# Altium project Stm32F429Zg.PrjPcb (part 2 of 3)

## Sheet GSM.SchDoc
size A2; SheetNumber: 3; SheetTotal: 8
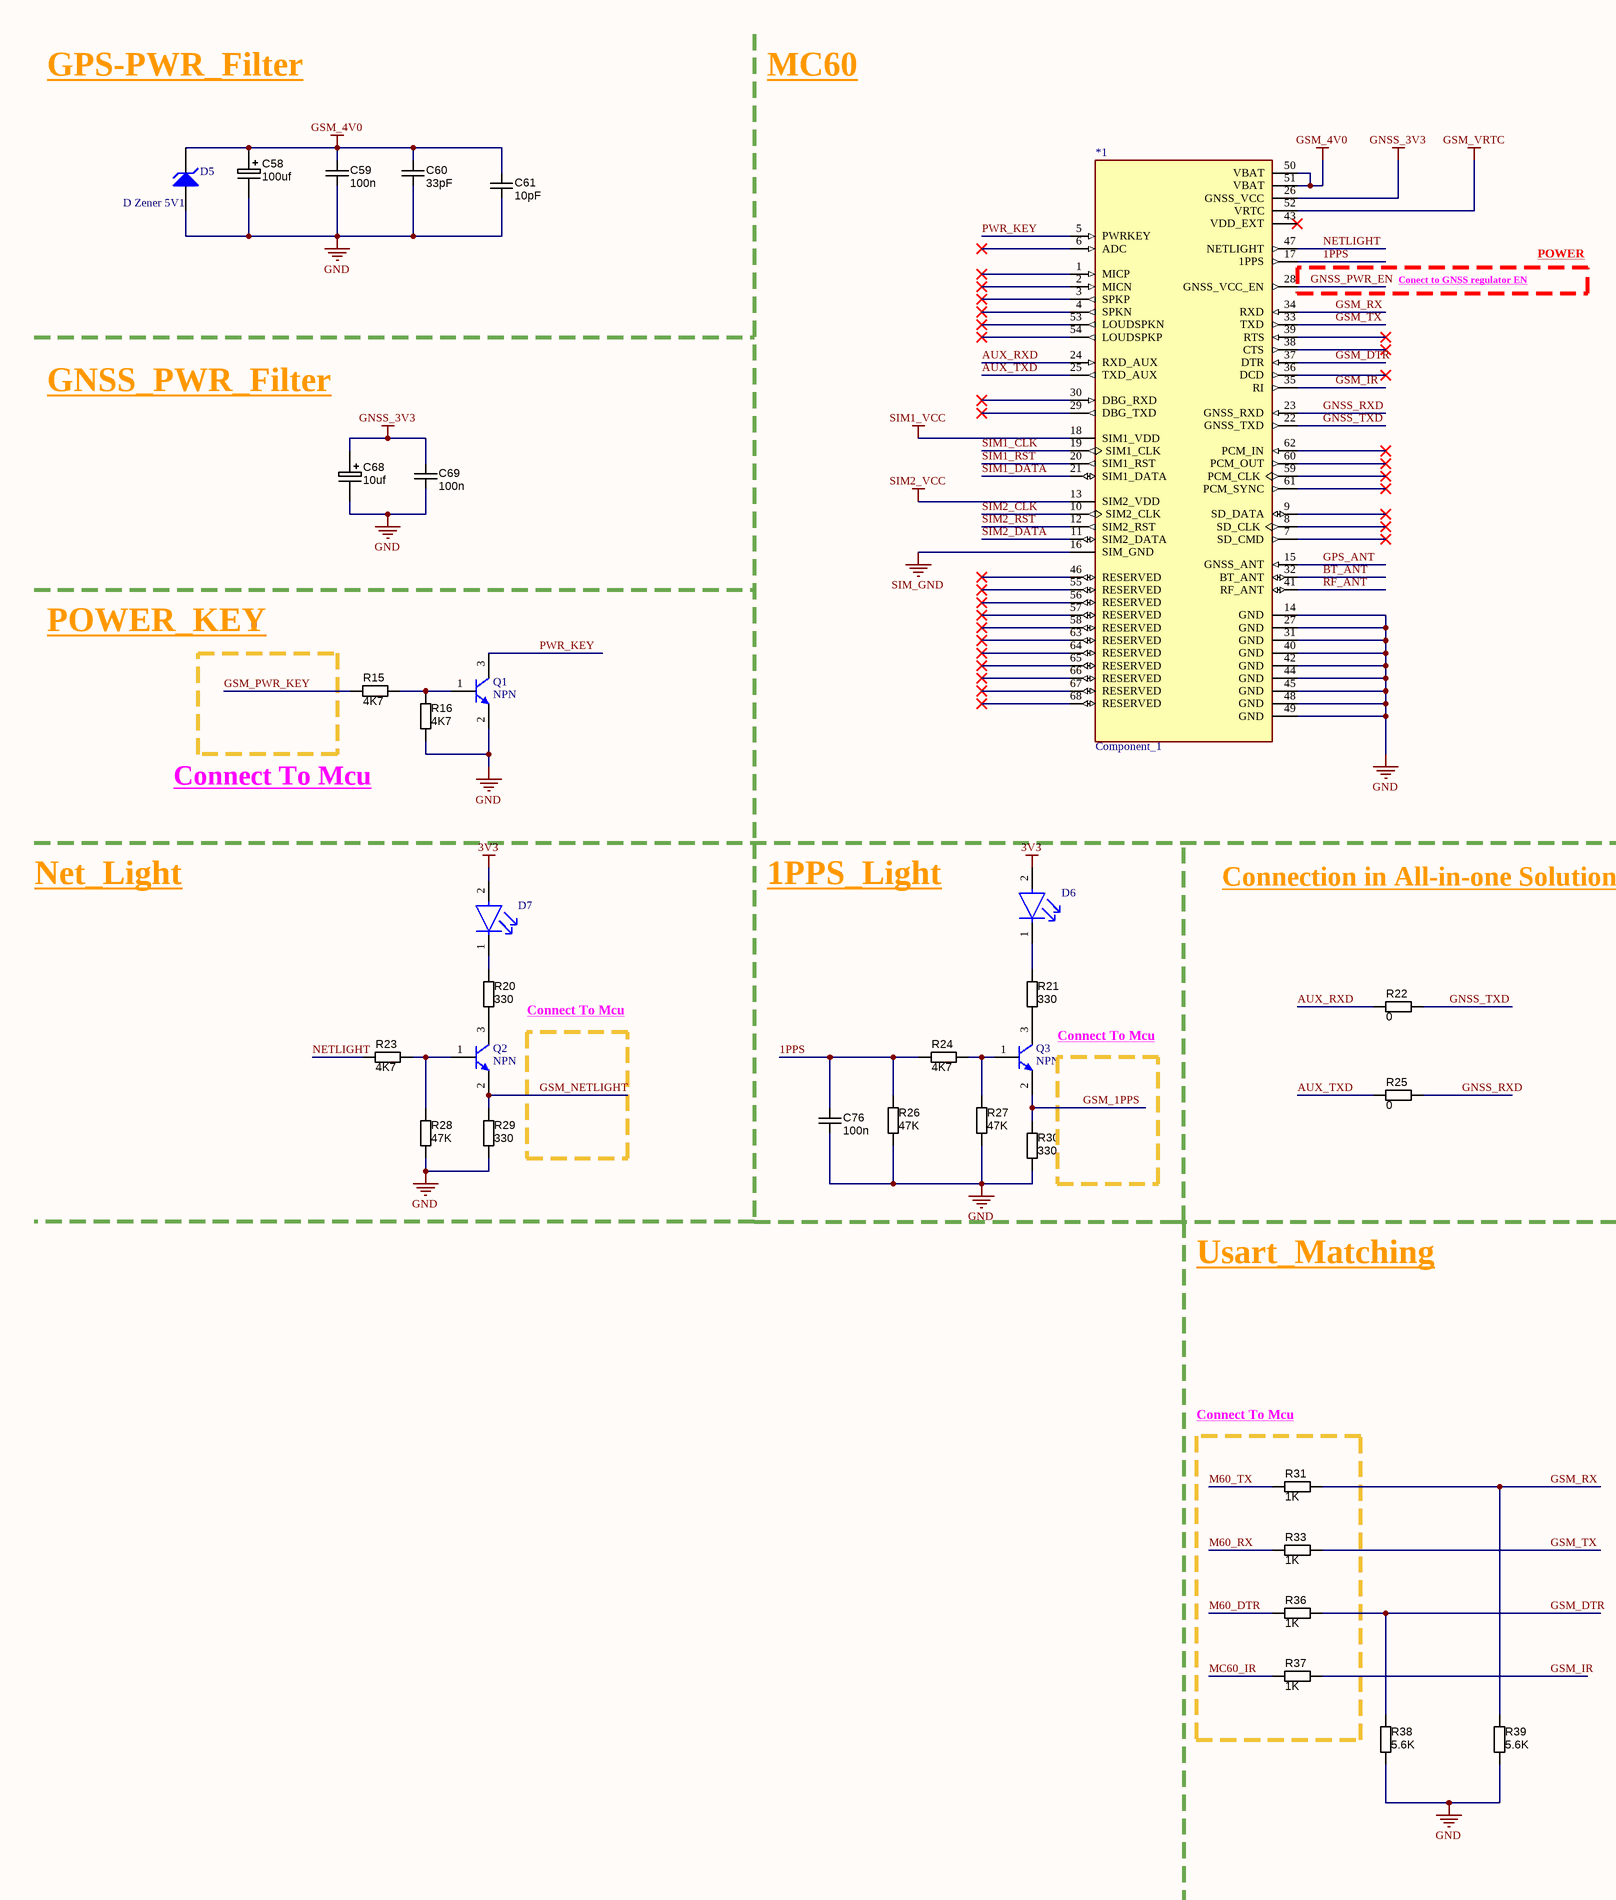
[diagram p2: GSM.SchDoc, left]
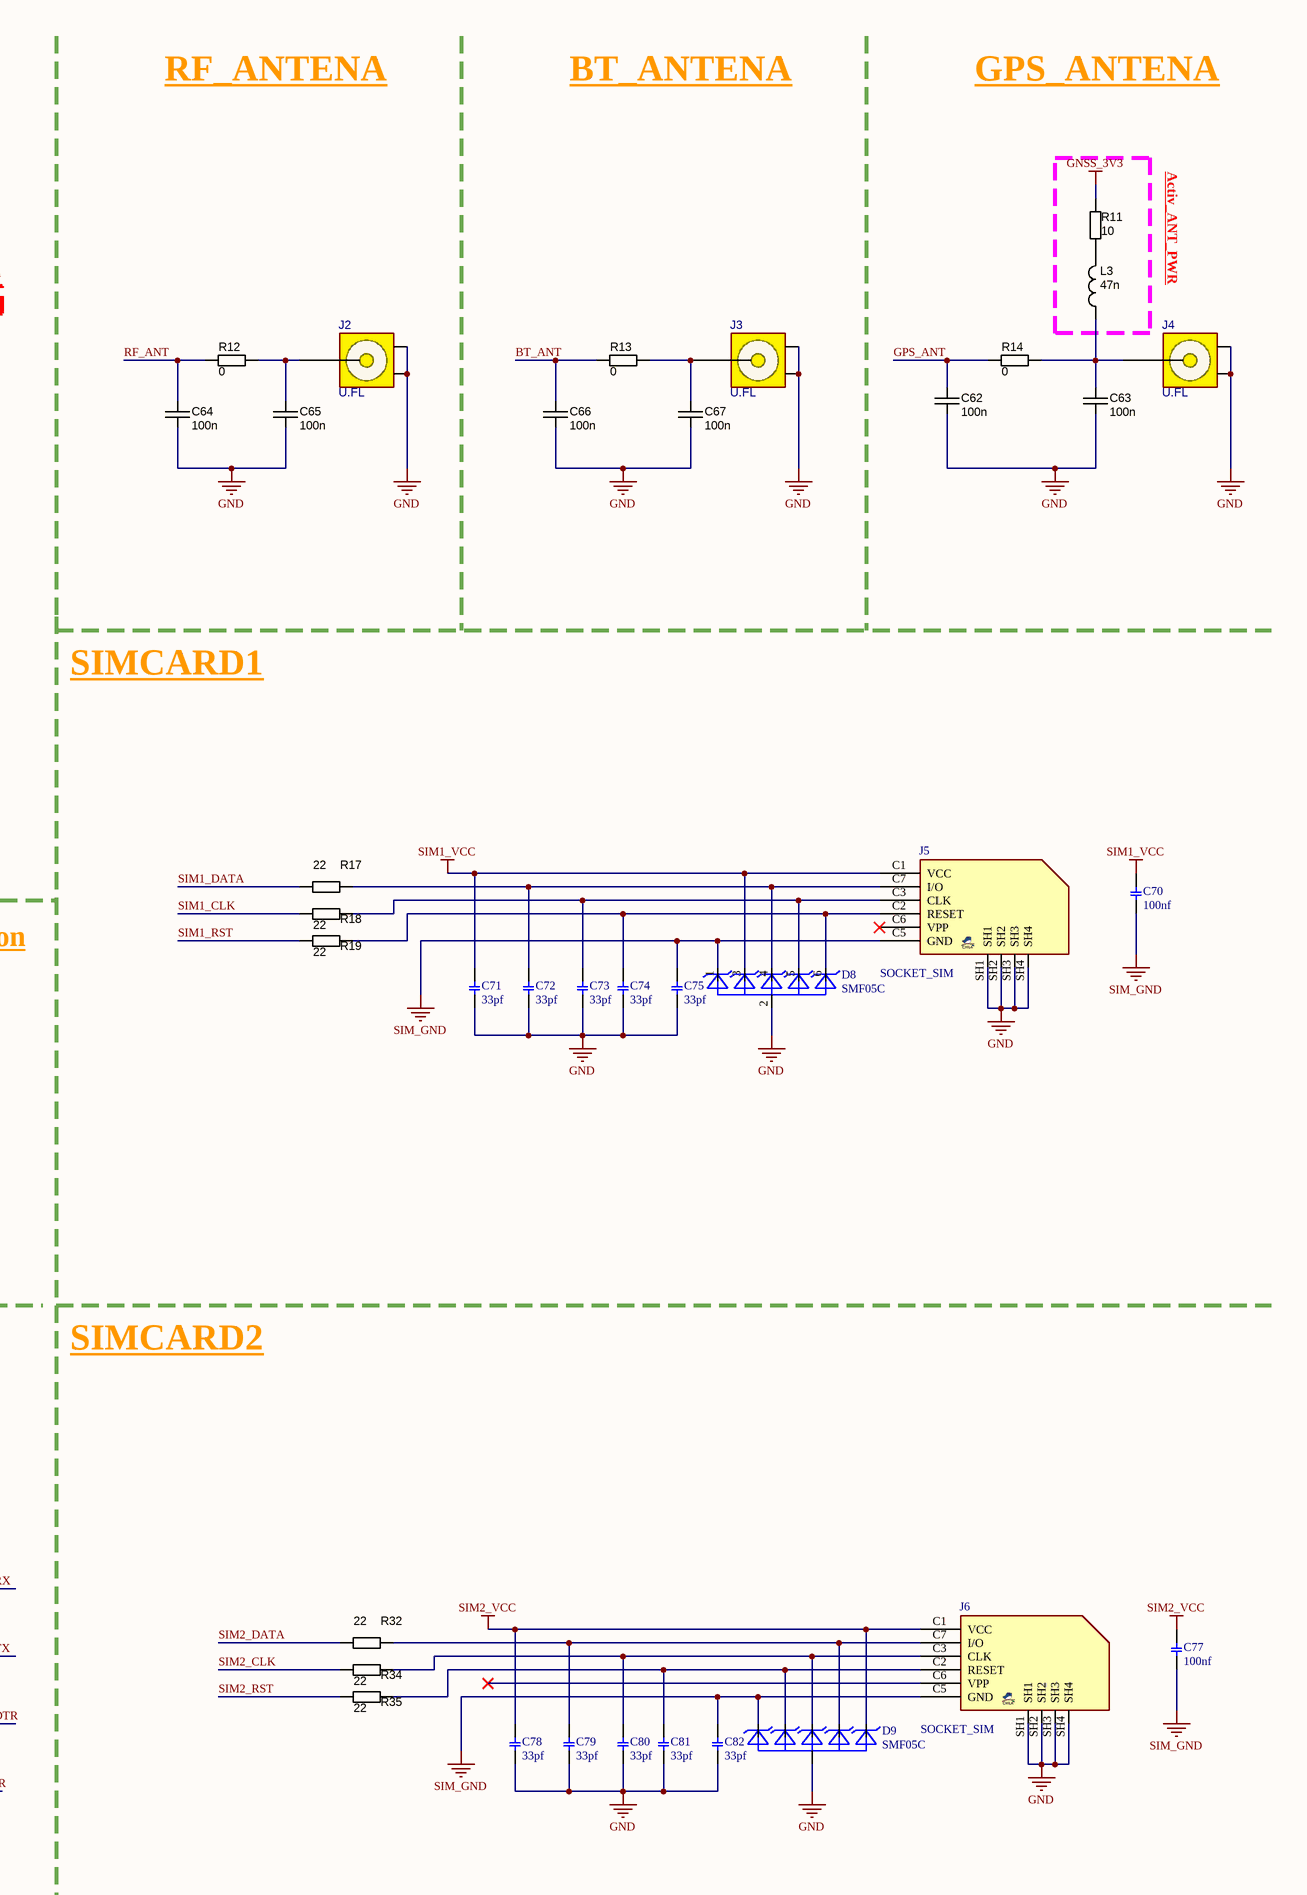
[diagram p3: GSM.SchDoc, right]

### Parts
*1  Component_1  [PCBComponent_1]
C58  value 100uf  [C_TN_3528]
C59  value 100n  [CAPC1608X90N]  (hidden comment: approved sub OK)
C60  value 33pF  [CAPC1608X90N]  (hidden comment: approved sub OK)
C61  value 10pF  [CAPC1608X90N]  (hidden comment: approved sub OK)
C62  value 100n  [C0402]  (hidden comment: approved sub OK)
C63  value 100n  [C0402]  (hidden comment: approved sub OK)
C64  value 100n  [C0402]  (hidden comment: approved sub OK)
C65  value 100n  [C0402]  (hidden comment: approved sub OK)
C66  value 100n  [C0402]  (hidden comment: approved sub OK)
C67  value 100n  [C0402]  (hidden comment: approved sub OK)
C68  value 10uf  [C_TN_3528]
C69  value 100n  [CAPC1608X90N]  (hidden comment: approved sub OK)
C70  value 100nf  [0603]  (hidden comment: Capacitor C SMD 0603)
C71  value 33pf  [0603]  (hidden comment: Capacitor C SMD 0603)
C72  value 33pf  [0603]  (hidden comment: Capacitor C SMD 0603)
C73  value 33pf  [0603]  (hidden comment: Capacitor C SMD 0603)
C74  value 33pf  [0603]  (hidden comment: Capacitor C SMD 0603)
C75  value 33pf  [0603]  (hidden comment: Capacitor C SMD 0603)
C76  value 100n  [CAPC1608X90N]  (hidden comment: approved sub OK)
C77  value 100nf  [0603]  (hidden comment: Capacitor C SMD 0603)
C78  value 33pf  [0603]  (hidden comment: Capacitor C SMD 0603)
C79  value 33pf  [0603]  (hidden comment: Capacitor C SMD 0603)
C80  value 33pf  [0603]  (hidden comment: Capacitor C SMD 0603)
C81  value 33pf  [0603]  (hidden comment: Capacitor C SMD 0603)
C82  value 33pf  [0603]  (hidden comment: Capacitor C SMD 0603)
D5  D Zener 5V1  [DIODE-0.7]
D6  LTST-C191TBKT  [FP-LTST-C191TBKT-MFG]  (value not drawn)
D7  LTST-C191TBKT  [FP-LTST-C191TBKT-MFG]  (value not drawn)
D8  SMF05C  [SC70-6]
D9  SMF05C  [SC70-6]
J2  U.FL  [UFL]
J3  U.FL  [UFL]
J4  U.FL  [UFL]
J5  SOCKET_SIM  [SIM_MICRO_GCT]
J6  SOCKET_SIM  [SIM_MICRO_GCT]
L3  47n  [L0603]
Q1  NPN  [SOT23-3]
Q2  NPN  [SOT23-3]
Q3  NPN  [SOT23-3]
R11  value 10  [0402]  (hidden comment: Thick Film)
R12  value 0  [0402]  (hidden comment: Thick Film)
R13  value 0  [0402]  (hidden comment: Thick Film)
R14  value 0  [0402]  (hidden comment: Thick Film)
R15  value 4K7  [RESC1608X55N]  (hidden comment: Thick Film)
R16  value 4K7  [RESC1608X55N]  (hidden comment: Thick Film)
R17  value 22  [RESC1608X55N]  (hidden comment: Thick Film)
R18  value 22  [RESC1608X55N]  (hidden comment: Thick Film)
R19  value 22  [RESC1608X55N]  (hidden comment: Thick Film)
R20  value 330  [RESC1608X55N]  (hidden comment: Thick Film)
R21  value 330  [RESC1608X55N]  (hidden comment: Thick Film)
R22  value 0  [RESC1608X55N]  (hidden comment: Thick Film)
R23  value 4K7  [RESC1608X55N]  (hidden comment: Thick Film)
R24  value 4K7  [RESC1608X55N]  (hidden comment: Thick Film)
R25  value 0  [RESC1608X55N]  (hidden comment: Thick Film)
R26  value 47K  [RESC1608X55N]  (hidden comment: Thick Film)
R27  value 47K  [RESC1608X55N]  (hidden comment: Thick Film)
R28  value 47K  [RESC1608X55N]  (hidden comment: Thick Film)
R29  value 330  [RESC1608X55N]  (hidden comment: Thick Film)
R30  value 330  [RESC1608X55N]  (hidden comment: Thick Film)
R31  value 1K  [RESC1608X55N]  (hidden comment: Thick Film)
R32  value 22  [RESC1608X55N]  (hidden comment: Thick Film)
R33  value 1K  [RESC1608X55N]  (hidden comment: Thick Film)
R34  value 22  [RESC1608X55N]  (hidden comment: Thick Film)
R35  value 22  [RESC1608X55N]  (hidden comment: Thick Film)
R36  value 1K  [RESC1608X55N]  (hidden comment: Thick Film)
R37  value 1K  [RESC1608X55N]  (hidden comment: Thick Film)
R38  value 5.6K  [RESC1608X55N]  (hidden comment: Thick Film)
R39  value 5.6K  [RESC1608X55N]  (hidden comment: Thick Film)

### Blocks framed on the sheet
Connect To Mcu: R31 R33 R36 R37

### Nets
3V3: D6.2(A) D7.2(A)  [project net VDD]
GND: *1.14(GND) *1.27(GND) *1.31(GND) *1.40(GND) *1.42(GND) *1.44(GND) *1.45(GND) *1.48(GND) *1.49(GND) C58.2 C59.2 C60.2 C61.2 C62.2 C63.2 C64.2 C65.2 C66.2 C67.2 C68.2 C69.2 C71.1 C72.1 C73.1 C74.1 C75.1 C76.2 C78.1 C79.1 C80.1 C81.1 C82.1 D5.1(A) D8.2(A) D9.2(A) J2.2(G1) J2.3(G2) J3.2(G1) J3.3(G2) J4.2(G1) J4.3(G2) J5.SH1 J5.SH2 J5.SH3 J5.SH4 J6.SH1 J6.SH2 J6.SH3 J6.SH4 Q1.2(E) R16.2 R26.2 R27.2 R28.2 R29.2 R30.2 R38.2 R39.2
GNSS_3V3: *1.26(GNSS_VCC) C68.1 C69.1 R11.1
GSM_4V0: *1.50(VBAT) *1.51(VBAT) C58.1 C59.1 C60.1 C61.1 D5.2(K)
GSM_VRTC: *1.52(VRTC)
SIM1_VCC: *1.18(SIM1_VDD) C70.2 C71.2 D8.3(C2) J5.C1(VCC)
SIM2_VCC: *1.13(SIM2_VDD) C77.2 C78.2 D9.6(C5) J6.C1(VCC)
SIM_GND: *1.16(SIM_GND) C70.1 C75.2 C77.1 C82.2 D8.1(C1) D9.1(C1) J5.C5(GND) J6.C5(GND)
1PPS: *1.17(1PPS) C76.1 R24.1 R26.1
AUX_RXD: *1.24(RXD_AUX) R22.2
AUX_TXD: *1.25(TXD_AUX) R25.2
BT_ANT: *1.32(BT_ANT) C66.1 R13.2
GNSS_PWR_EN: *1.28(GNSS_VCC_EN)
GNSS_RXD: *1.23(GNSS_RXD) R25.1
GNSS_TXD: *1.22(GNSS_TXD) R22.1
GPS_ANT: *1.15(GNSS_ANT) C62.1 R14.2
GSM_1PPS: Q3.2(E) R30.1
GSM_DTR: *1.37(DTR) R36.1 R38.1
GSM_IR: *1.35(RI) R37.1
GSM_NETLIGHT: Q2.2(E) R29.1
GSM_PWR_KEY: R15.2
GSM_RX: *1.34(RXD) R31.1 R39.1
GSM_TX: *1.33(TXD) R33.1
M60_DTR: R36.2
M60_RX: R33.2
M60_TX: R31.2
MC60_IR: R37.2
NETLIGHT: *1.47(NETLIGHT) R23.1
PWR_KEY: *1.5(PWRKEY) Q1.3(C)
RF_ANT: *1.41(RF_ANT) C64.1 R12.2
SIM1_CLK: *1.19(SIM1_CLK) R18.1
SIM1_DATA: *1.21(SIM1_DATA) R17.1
SIM1_RST: *1.20(SIM1_RST) R19.1
SIM2_CLK: *1.10(SIM2_CLK) R34.1
SIM2_DATA: *1.11(SIM2_DATA) R32.1
SIM2_RST: *1.12(SIM2_RST) R35.1
NetC63_1: C63.1 J4.1(SIG) L3.1 R14.1
NetC65_1: C65.1 J2.1(SIG) R12.1
NetC67_1: C67.1 J3.1(SIG) R13.1
NetC72_2: C72.2 D8.4(C3) J5.C7(I/O) R17.2
NetC73_2: C73.2 D8.5(C4) J5.C3(CLK) R18.2
NetC74_2: C74.2 D8.6(C5) J5.C2(RESET) R19.2
NetC79_2: C79.2 D9.5(C4) J6.C7(I/O) R32.2
NetC80_2: C80.2 D9.4(C3) J6.C3(CLK) R34.2
NetC81_2: C81.2 D9.3(C2) J6.C2(RESET) R35.2
NetD6_1: D6.1(C) R21.1
NetD7_1: D7.1(C) R20.1
NetL3_2: L3.2 R11.2
NetQ1_1: Q1.1(B) R15.1 R16.1
NetQ2_1: Q2.1(B) R23.2 R28.1
NetQ2_3: Q2.3(C) R20.2
NetQ3_1: Q3.1(B) R24.2 R27.1
NetQ3_3: Q3.3(C) R21.2

Not connected (* = marked no-connect by the designer): *1 1(MICP)* 2(MICN)* 3(SPKP)* 4(SPKN)* 6(ADC)* 7(SD_CMD)* 8(SD_CLK)* 9(SD_DATA)* 29(DBG_TXD)* 30(DBG_RXD)* 36(DCD)* 38(CTS)* 39(RTS)* 43(VDD_EXT)* 46(RESERVED)* 53(LOUDSPKN)* 54(LOUDSPKP)* 55(RESERVED)* 56(RESERVED)* 57(RESERVED)* 58(RESERVED)* 59(PCM_CLK)* 60(PCM_OUT)* 61(PCM_SYNC)* 62(PCM_IN)* 63(RESERVED)* 64(RESERVED)* 65(RESERVED)* 66(RESERVED)* 67(RESERVED)* 68(RESERVED)*; J5 C6(VPP)*; J6 C6(VPP)*

### Notes on the sheet
- GPS-PWR_Filter
- MC60
- RF_ANTENA
- BT_ANTENA
- GPS_ANTENA
- Activ_ANT_PWR
- Conect to GNSS regulator EN
- POWER
- GNSS_PWR_Filter
- POWER_KEY
- SIMCARD1
- Connect To Mcu
- Net_Light
- 1PPS_Light
- Connection in All-in-one Solution
- Usart_Matching
- SIMCARD2
- Title:
- Serial Number:
- Author:
- Revision:
- AmirMahdiHasanzadeh
- 4LB_V1.0.0
- Sheet       of
- Drawn By:
- Sheet Size: A2
- 3
- AmirMAhdiHasanzadeh
- File:
- Approved By:
- Date:
- 2021/11/08

### Library data of the parts
C58 = CAPT_4u7_3216_16V: Capacitor SMD Tantalum 100uF 10% 16V 3216-18; Manufacturer 1: Vishay/Sprague; Manufacturer Part Number 1: 293D475X9016A2TE3; SCDType: undef; Package / Case: EIA 535BAAC size A; Ratings: 16V; Tolerance: ±10%; Material: Tantalum; Supplier 1: Digi-Key; Supplier Part Number 1: 718-1148-1-ND
C59 C62-C67 C69 C76 = CAPC_100n_0603_X7R_50V_10%: Capacitor SMD Cer 100nF 10% 50V X7R 0603; Manufacturer 1: AVX Corporation; Manufacturer Part Number 1: 06035C104KAT2A; Ratings: 50V; X7R; Material: ceramic; SCDType: spec; Manufacturer 2: TDK Corporation; Manufacturer Part Number 2: C1608X7R1H104K; Package / Case: 0603 (1608 Metric); Tolerance: ±10%; Supplier 1: Digi-Key; Supplier Part Number 1: 478-5052-1-ND; ComponentLink1URL: http://www.avx.com/docs/Catalogs/cx7r.pdf; ComponentLink1Description: http://www.avx.com/docs/Catalogs/cx7r.pdf; Supplier 2: Digi-Key; Supplier Part Number 2: 445-1314-1-ND; ComponentLink2URL: http://product.tdk.com/capacitor/mlcc/en/documents/mlcc_commercial_general_en.pdf; ComponentLink2Description: http://product.tdk.com/capacitor/mlcc/en/documents/mlcc_commercial_general_en.pdf
C60 = CAPC_100n_0603_X7R_50V_10%: Capacitor SMD Cer 33pF10% 50V X7R 0603; Manufacturer 1: AVX Corporation; Manufacturer Part Number 1: 06035C104KAT2A; Tolerance: ±10%; Ratings: 50V; X7R; Material: ceramic; SCDType: spec; Manufacturer 2: TDK Corporation; Manufacturer Part Number 2: C1608X7R1H104K; Package / Case: 0603 (1608 Metric); Supplier 1: Digi-Key; Supplier Part Number 1: 478-5052-1-ND; ComponentLink1URL: http://www.avx.com/docs/Catalogs/cx7r.pdf; ComponentLink1Description: http://www.avx.com/docs/Catalogs/cx7r.pdf; Supplier 2: Digi-Key; Supplier Part Number 2: 445-1314-1-ND; ComponentLink2URL: http://product.tdk.com/capacitor/mlcc/en/documents/mlcc_commercial_general_en.pdf; ComponentLink2Description: http://product.tdk.com/capacitor/mlcc/en/documents/mlcc_commercial_general_en.pdf
C61 = CAPC_100n_0603_X7R_50V_10%: Capacitor SMD Cer 10pF10% 50V X7R 0603; Manufacturer 1: AVX Corporation; Manufacturer Part Number 1: 06035C104KAT2A; Tolerance: ±10%; Ratings: 50V; X7R; Material: ceramic; SCDType: spec; Manufacturer 2: TDK Corporation; Manufacturer Part Number 2: C1608X7R1H104K; Package / Case: 0603 (1608 Metric); Supplier 1: Digi-Key; Supplier Part Number 1: 478-5052-1-ND; ComponentLink1URL: http://www.avx.com/docs/Catalogs/cx7r.pdf; ComponentLink1Description: http://www.avx.com/docs/Catalogs/cx7r.pdf; Supplier 2: Digi-Key; Supplier Part Number 2: 445-1314-1-ND; ComponentLink2URL: http://product.tdk.com/capacitor/mlcc/en/documents/mlcc_commercial_general_en.pdf; ComponentLink2Description: http://product.tdk.com/capacitor/mlcc/en/documents/mlcc_commercial_general_en.pdf
C68 = CAPT_4u7_3216_16V: Capacitor SMD Tantalum 10uF 10% 16V 3216-18; Manufacturer 1: Vishay/Sprague; Manufacturer Part Number 1: 293D475X9016A2TE3; SCDType: undef; Package / Case: EIA 535BAAC size A; Ratings: 16V; Tolerance: ±10%; Material: Tantalum; Supplier 1: Digi-Key; Supplier Part Number 1: 718-1148-1-ND
D5 = D Zener: Zener Diode; Published: 8-Jun-2000; LatestRevisionDate: 17-Jul-2002; LatestRevisionNote: Re-released for DXP Platform.; PackageReference: DIODE-0.7; Publisher: Altium Limited; PackageDescription: Diode, Thru-Hole; 2 Leads; 0.7 in Pin Spacing
D6 D7 = CMP-22017-000008-1: LED BLUE CLEAR CHIP SMD; Lens Color: Colorless; Dominant Wavelength: 475nm; Forward Current: 20mA; Wavelength: 468nm; Viewing Angle: 130°; Power Dissipation: 76mW; Luminous Intensity: 180mcd; Reverse Voltage: 5V; Number of Elements: 1; Lens Style: Diffused; Forward Voltage: 3.8V; Max Power Dissipation: 75mW; Case Code (Metric): 1608; Packaging: Tape and Reel; Case/Package: 0603; Depth: 1.6mm; Mount: Surface Mount; Lead Free: Lead Free; Min Operating Temperature: -20°C; Lens Transparency: Clear; Illumination Color: Blue; Height: 0.55mm; Test Current: 20mA; Case Code (Imperial): 0603; Max Operating Temperature: 80°C; Number of Pins: 2; Length: 0.8mm; Radiation Hardening: No; Package Quantity: 1; Number of LEDs: 1; Width: 0.8mm; Color: Blue
D8 D9 = SMF05C: 12.5V Clamp 8A _8/20Âµs_ Ipp Tvs Diode Surface Mount SC-88/SC70-6/SOT-363; MF: ON Semiconductor; Availability: Unavailable; Price: None; Package: SOT-363 ON Semiconductor; Value: *; SnapEDA_Link: https://www.snapeda.com/parts/SMF05C/ON%20Semiconductor/view-part/2782704/?ref=snap; MP: SMF05C
J2-J4 = CONN_RF_UFL: CONN, RF, U.FL, STRAIGHT, Ultra Miniature Coaxial; MANF_P#: CONUFL001-SMD, U.FL-R-SMT-1(10), 128-0711-201; MANF: Linx, Hirose, Cinch; PARAM: 50Ohm, 6GHz; DESC: DESCRIPTION; DIST#: DIGIKEY, MOUSER; PARAM2: GOLD; ASSEMBLY: ASSEMBLY; PRICE: 0.9$; VALUE: U.FL
J5 J6 = SIM_MICRO_6: SOCKET, SIM MICRO; MANF: -; PRICE: 3t@Lion Iran; MANF_P#: -; DESC: -; VALUE: SOCKET_SIM
L3 = INDC_10u_LowRDC: Inductor SMD Low DCR 47 nH 900mA 20% 1210; Manufacturer 1: Taiyo Yuden; Manufacturer Part Number 1: CBC3225T100MR; Ratings: 900 mA; 133 mOhm; DC Resistance (DCR): 172.9 mOhm Max; Frequency - Self Resonant: 23MHz; Frequency - Test: 100kHz; SCDType: spec; Tolerance: ±20%; Supplier 1: Digi-Key; Supplier Part Number 1: 587-1625-1-ND; Current: 900mA; Current - Saturation: 900mA; Current - Temperature Rise: 900mA; Applications: Power Supplies; Package / Case: 1210 (3225 Metric); Operating Temperature: -40°C ~ 105°C; ComponentLink1URL: http://www.yuden.co.jp/ut/product/pdf/wound02_e.pdf; ComponentLink1Description: http://www.yuden.co.jp/ut/product/pdf/wound02_e.pdf; Value: 47n
Q1-Q3 = NPN: NPN Bipolar Transistor; Published: 8-Jun-2000; LatestRevisionDate: 17-Jul-2002; LatestRevisionNote: Re-released for DXP Platform.; PackageReference: TO-226-AA; Publisher: Altium Limited; PackageDescription: TO, Flat Index; 3 In-Line, Axial Leads; Body Dia. 4.8mm; Leads 0.55 x 0.51 mm (max); Code_JEDEC: TO-226-AA
R11 = RES_4K7_0603_5%: Resistor SMD chip 10 Ohm 0.1W 5% 0603; Manufacturer 1: Vishay/Dale; Manufacturer Part Number 1: CRCW06034K70JNEA; Ratings: 1/10 W; SCDType: spec; Package / Case: 0603 (1608 metric); Tolerance: ±5%; Material: Thick Film; Supplier 1: Digi-Key; Supplier Part Number 1: 541-4.7KGCT-ND
R12-R14 R22 R25 = RES_4K7_0603_5%: Resistor SMD chip 0 Ohm 0.1W 5% 0603; Manufacturer 1: Vishay/Dale; Manufacturer Part Number 1: CRCW06034K70JNEA; Ratings: 1/10 W; SCDType: spec; Package / Case: 0603 (1608 metric); Tolerance: ±5%; Material: Thick Film; Supplier 1: Digi-Key; Supplier Part Number 1: 541-4.7KGCT-ND
R15 R16 R23 R24 = RES_4K7_0603_5%: Resistor SMD chip 4.7k Ohm 0.1W 5% 0603; Manufacturer 1: Vishay/Dale; Manufacturer Part Number 1: CRCW06034K70JNEA; Ratings: 1/10 W; SCDType: spec; Package / Case: 0603 (1608 metric); Tolerance: ±5%; Material: Thick Film; Supplier 1: Digi-Key; Supplier Part Number 1: 541-4.7KGCT-ND
R17-R19 R32 R34 R35 = RES_4K7_0603_5%: Resistor SMD chip 22 Ohm 0.1W 5% 0603; Manufacturer 1: Vishay/Dale; Manufacturer Part Number 1: CRCW06034K70JNEA; Ratings: 1/10 W; SCDType: spec; Package / Case: 0603 (1608 metric); Tolerance: ±5%; Material: Thick Film; Supplier 1: Digi-Key; Supplier Part Number 1: 541-4.7KGCT-ND
R20 R21 R29 R30 = RES_4K7_0603_5%: Resistor SMD chip 330 Ohm 0.1W 5% 0603; Manufacturer 1: Vishay/Dale; Manufacturer Part Number 1: CRCW06034K70JNEA; Ratings: 1/10 W; SCDType: spec; Package / Case: 0603 (1608 metric); Tolerance: ±5%; Material: Thick Film; Supplier 1: Digi-Key; Supplier Part Number 1: 541-4.7KGCT-ND
R26-R28 = RES_4K7_0603_5%: Resistor SMD chip 47K Ohm 0.1W 5% 0603; Manufacturer 1: Vishay/Dale; Manufacturer Part Number 1: CRCW06034K70JNEA; Ratings: 1/10 W; SCDType: spec; Package / Case: 0603 (1608 metric); Tolerance: ±5%; Material: Thick Film; Supplier 1: Digi-Key; Supplier Part Number 1: 541-4.7KGCT-ND
R31 R33 R36 R37 = RES_4K7_0603_5%: Resistor SMD chip 1K Ohm 0.1W 5% 0603; Manufacturer 1: Vishay/Dale; Manufacturer Part Number 1: CRCW06034K70JNEA; Ratings: 1/10 W; SCDType: spec; Package / Case: 0603 (1608 metric); Tolerance: ±5%; Material: Thick Film; Supplier 1: Digi-Key; Supplier Part Number 1: 541-4.7KGCT-ND
R38 R39 = RES_4K7_0603_5%: Resistor SMD chip 5.6K Ohm 0.1W 5% 0603; Manufacturer 1: Vishay/Dale; Manufacturer Part Number 1: CRCW06034K70JNEA; Ratings: 1/10 W; SCDType: spec; Package / Case: 0603 (1608 metric); Tolerance: ±5%; Material: Thick Film; Supplier 1: Digi-Key; Supplier Part Number 1: 541-4.7KGCT-ND
C70-C75 C77-C82 = Capacitor C SMD 0603: DatasheetVersion: 2021; ComponentLink1Description: Website Smart World; ComponentLink1URL: https://www.smartw.ir/; ComponentLink2Description: Telegram; ComponentLink2URL: https://t.me/altium_smartw; ComponentLink3Description: Instagram; ComponentLink3URL: https://Instagram.com/smartgw.ir

## Sheet ADC.SchDoc
size A4; SheetNumber: 4; SheetTotal: 8
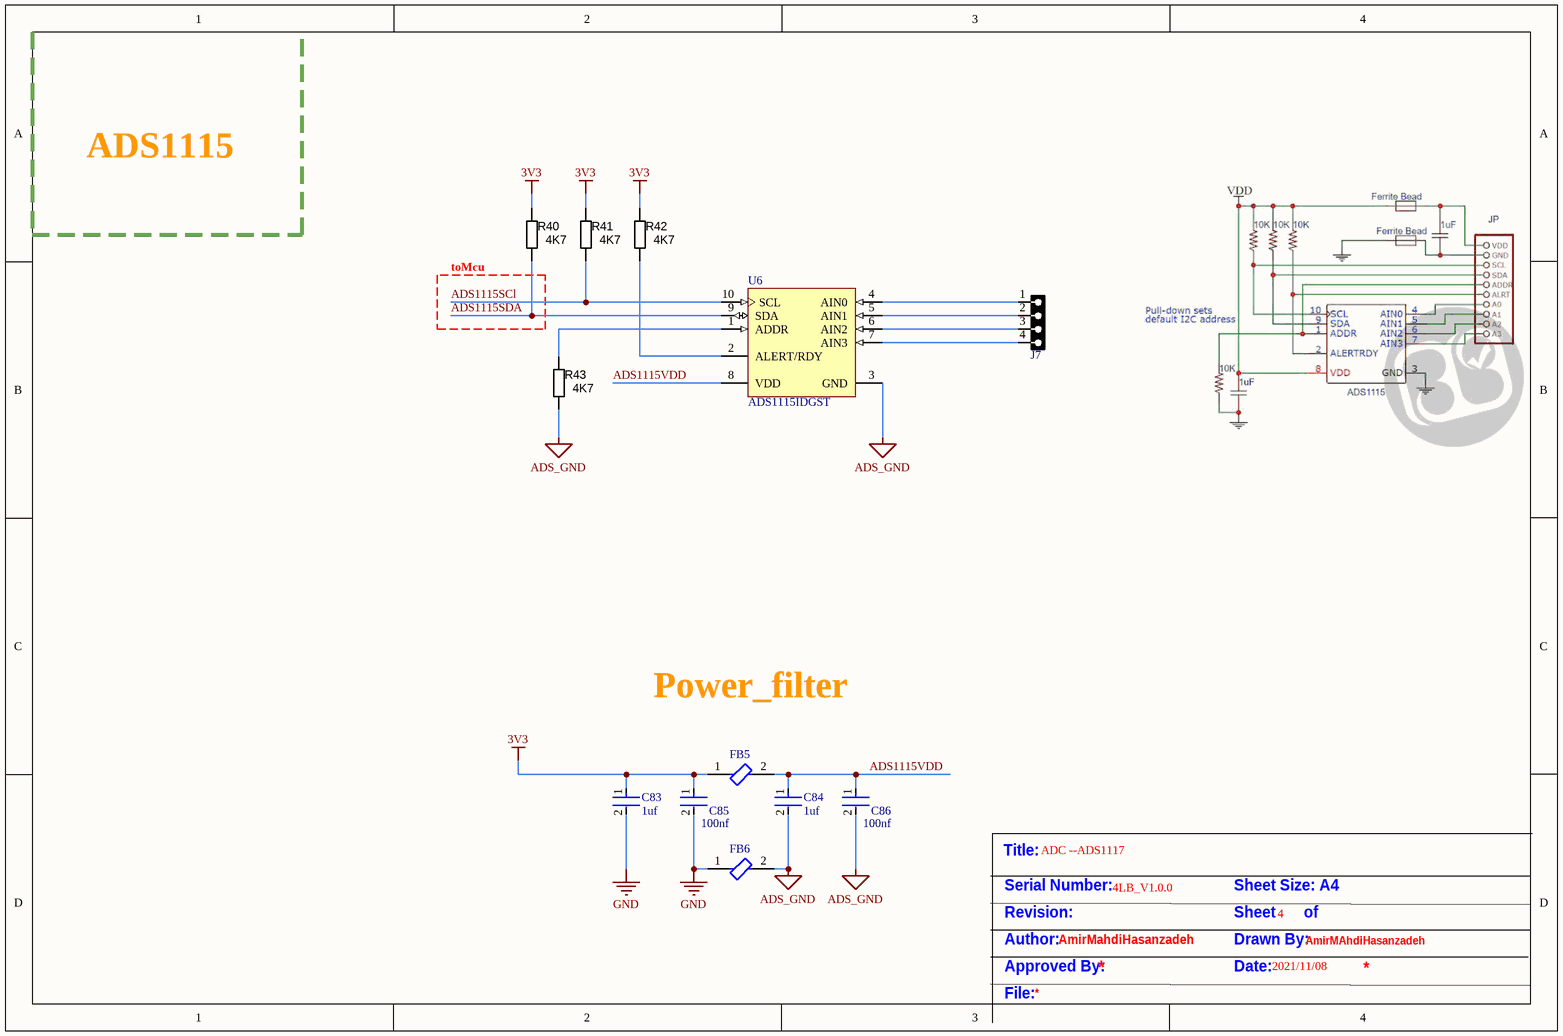
[diagram p4: ADC.SchDoc]

### Parts
C83  1uf  [FP-GRM31C-0_2-e0_3_0_8-MFG]
C84  1uf  [FP-GRM31C-0_2-e0_3_0_8-MFG]
C85  100nf  [FP-CGA3E-0_3-0_1-IPC_A]
C86  100nf  [FP-CGA3E-0_3-0_1-IPC_A]
FB5  MMZ1608R600ATA00  [FP-MMZ1608-0_8-MFG]  (value not drawn)
FB6  MMZ1608R600ATA00  [FP-MMZ1608-0_8-MFG]  (value not drawn)
J7  HDRF4  [HDR_F_1X4]  (value not drawn)
R40  value 4K7  [RESC1608X55N]  (hidden comment: Thick Film)
R41  value 4K7  [RESC1608X55N]  (hidden comment: Thick Film)
R42  value 4K7  [RESC1608X55N]  (hidden comment: Thick Film)
R43  value 4K7  [RESC1608X55N]  (hidden comment: Thick Film)
U6  ADS1115IDGST  [TI-DGS10_M]

### Nets
3V3: C83.1 C85.1 FB5.1 R40.1 R41.1 R42.1  [project net VDD]
ADS_GND: C84.2 C86.2 FB6.2 R43.2 U6.3(GND)
GND: C83.2 C85.2 FB6.1
ADS1115SCl: R41.2 U6.10(SCL)
ADS1115SDA: R40.2 U6.9(SDA)
ADS1115VDD: C84.1 C86.1 FB5.2 U6.8(VDD)
NetJ7_1: J7.1 U6.4(AIN0)
NetJ7_2: J7.2 U6.5(AIN1)
NetJ7_3: J7.3 U6.6(AIN2)
NetJ7_4: J7.4 U6.7(AIN3)
NetR42_2: R42.2 U6.2(ALERT/RDY)
NetR43_1: R43.1 U6.1(ADDR)

### Notes on the sheet
- ADS1115
- (near R40) toMcu
- Power_filter
- Title:
- ADC --ADS1117
- Serial Number:
- Revision:
- 4LB_V1.0.0
- Sheet       of
- Sheet Size: A4
- 4
- Author:
- Approved By:
- AmirMahdiHasanzadeh
- Date:
- Drawn By:
- 2021/11/08
- AmirMAhdiHasanzadeh
- File:

### Library data of the parts
C83 C84 = CMP-06035-003841-1: Chip Multilayer Ceramic Capacitors for General Purpose, 1206, 10uF, X7R, 15%, 10%, 10V; Capacitance: 22uF; Height: 1.6mm; Width: 0.063inch; Min Operating Temperature: -55°C; Package Quantity: 1; Termination: SMD/SMT; Length: 3.2mm; Voltage Rating: 10V; Case/Package: 1206; Case Code (Imperial): 1206; Depth: 1.6mm; Dielectric: X7R; Voltage: 10V; Material: Ceramic; Tolerance: 10%; Voltage Rating (DC): 10V; Lead Free: Lead Free; Max Operating Temperature: 125°C; Case Code (Metric): 3216; Packaging: Tape and Reel; Thickness: 0.071inch; Radiation Hardening: No; REACH SVHC: No SVHC; Mount: Surface Mount
C85 C86 = CMP-2000-07546-2: Cap Ceramic 100nF 50V X7R 10% Pad SMD 0603 +125°C Automotive T/R; Weight: 7.1E-05oz; Composition: Ceramic; Max Operating Temperature: 125°C; Termination: SMD/SMT; Dielectric: X7R; Length: 1.6mm; Package Quantity: 1; REACH SVHC: No SVHC; Lead Free: Lead Free; Case Code (Metric): 1608; Min Operating Temperature: -55°C; Packaging: Tape and Reel; Tolerance: 10%; Voltage Rating: 50V; Case Code (Imperial): 0603; Capacitance: 100nF; Case/Package: 0603; Voltage Rating (DC): 50V; Depth: 0.8mm; Radiation Hardening: No; Ratings: AEC-Q200; Mount: Surface Mount; Voltage: 50V; Thickness: 0.035inch; Width: 0.8mm; Height: 0.8mm
FB5 FB6 = CMP-08257-000150-1: Signal Line Ferrite Bead 60Ω  @ 100MHz 800mA DCR 100mΩ SMD 0603; DC Resistance (DCR): 100mR; Tolerance: 25%; Impedance: 60R; Width: 0.031inch; Mount: Surface Mount; Max DC Current: 800mA; Series: MMZ; RoHS Compliant: Yes; Package Quantity: 1; Current Rating: 800mA; Depth: 0.8mm; Case Code (Imperial): 0603; Length: 0.063inch; Case Code (Metric): 1608; Height: 0.037inch; Core Material: Ferrite; REACH SVHC: No SVHC; Case/Package: 0603; Packaging: Cut Tape
J7 = HDR_F_1X4: CONN, HEADER, Female, pitch: 2.54mm, 4POS; VALUE: HDRF4
R40-R43 = RES_4K7_0603_5%: as R15 on sheet GSM; Package / Case: 0603 (1608 metric); Tolerance: ±5%; Material: Thick Film; Supplier 1: Digi-Key; Supplier Part Number 1: 541-4.7KGCT-ND
U6 = CMP-0003-00378-2: 16-Bit ADC with Integrated Multiplexer, PGA, Comparator, Oscillator, and Reference, -40 to 125 degC, 10-pin SOP (DGS10), Green (RoHS & no Sb/Br); Manufacturer: Texas Instruments; Sample Rate (max)(SPS): 860; SubFamily: Precision ADC (<=10MSPS); Architecture: Delta-Sigma; Digital Supply(Min)(V): 2; Resolution(Bits): 16; Digital Supply(Max)(V): 5.5; INL(Max)(+/-LSB): 1; Interface: Serial I2C; # Input Channels: 4; Eco-Plan: Green (RoHS & no Sb/Br); PackageDescription: 10-Pin Plastic Small Outline, Body 3 x 3 mm, Pitch 0.5 mm; Mounting Technology: Surface Mount; PackageReference: DGS10; DatasheetVersion: SBAS444B; ComponentLink3Description: Package Specification; ComponentLink1Description: Manufacturer URL; PartNumber: ADS1115IDGST; ComponentLink3URL: http://www.ti.com/lit/ml/mpds035b/mpds035b.pdf; ComponentLink2URL: http://www.ti.com/general/docs/lit/getliterature.tsp?genericPartNumber=ADS1115&fileType=pdf; Analog Voltage AV/DD(Min)(V): 2; ComponentLink2Description: Datasheet; PackageVersion: 4073272/C, 02/2004; Analog Voltage AV/DD(Max)(V): 5.5; Code_JEDEC: MO-153; ComponentLink1URL: http://www.ti.com/

## Sheet Esp8266.SchDoc
size A3; SheetNumber: 5; SheetTotal: 8
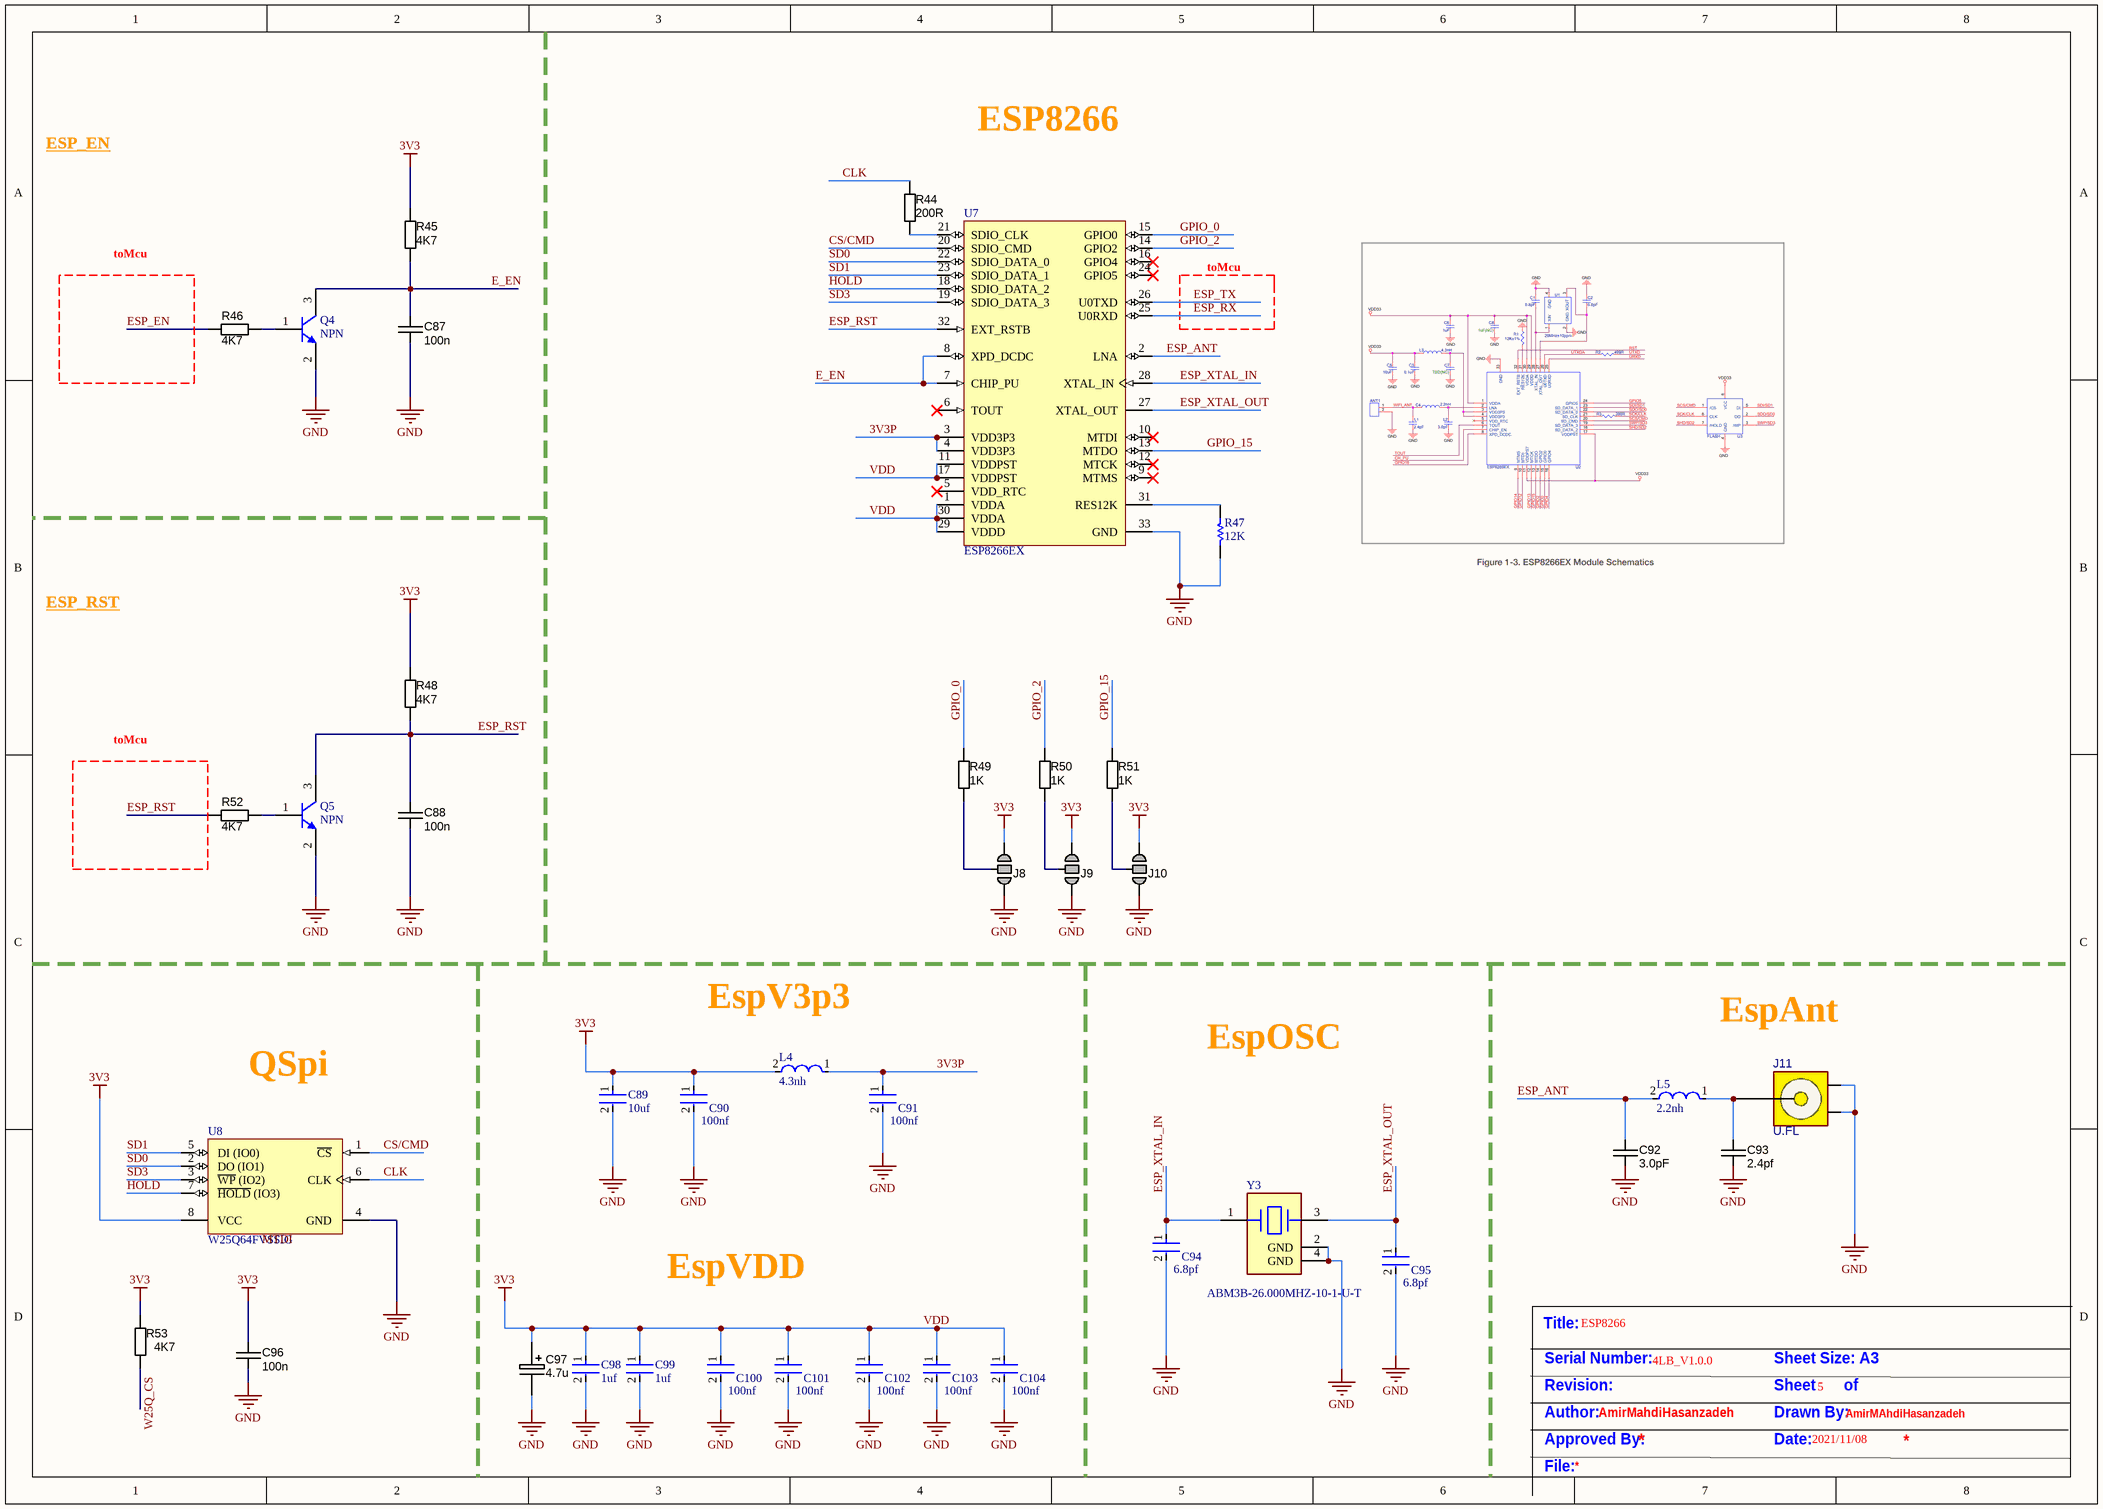
[diagram p5: Esp8266.SchDoc]

### Parts
C87  value 100n  [CAPC1608X90N]  (hidden comment: approved sub OK)
C88  value 100n  [CAPC1608X90N]  (hidden comment: approved sub OK)
C89  10uf  [FP-GRM31C-0_2-e0_3_0_8-MFG]
C90  100nf  [FP-CGA3E-0_3-0_1-IPC_A]
C91  100nf  [FP-CGA3E-0_3-0_1-IPC_A]
C92  3.0pF  [C0402]
C93  value 2.4pf  [C0402]  (hidden comment: approved sub OK)
C94  6.8pf  [FP-CGA3E-0_3-0_1-IPC_A]
C95  6.8pf  [FP-CGA3E-0_3-0_1-IPC_A]
C96  value 100n  [CAPC1608X90N]  (hidden comment: approved sub OK)
C97  value 4.7u  [C_TN_3528]
C98  1uf  [FP-GRM31C-0_2-e0_3_0_8-MFG]
C99  1uf  [FP-GRM31C-0_2-e0_3_0_8-MFG]
C100  100nf  [FP-CGA3E-0_3-0_1-IPC_A]
C101  100nf  [FP-CGA3E-0_3-0_1-IPC_A]
C102  100nf  [FP-CGA3E-0_3-0_1-IPC_A]
C103  100nf  [FP-CGA3E-0_3-0_1-IPC_A]
C104  100nf  [FP-CGA3E-0_3-0_1-IPC_A]
J8  Jumper  [Jump_3Way]  (value not drawn)  (no BOM)
J9  Jumper  [Jump_3Way]  (value not drawn)  (no BOM)
J10  Jumper  [Jump_3Way]  (value not drawn)  (no BOM)
J11  U.FL  [UFL]
L4  4.3nh  [FP-CBMF1608-MFG]
L5  2.2nh  [FP-CBMF1608-MFG]
Q4  NPN  [SOT23-3]
Q5  NPN  [SOT23-3]
R44  value 200R  [RESC1608X55N]  (hidden comment: Thick Film)
R45  value 4K7  [RESC1608X55N]  (hidden comment: Thick Film)
R46  value 4K7  [RESC1608X55N]  (hidden comment: Thick Film)
R47  12K  [RESC1608X55X25ML10T15]
R48  value 4K7  [RESC1608X55N]  (hidden comment: Thick Film)
R49  value 1K  [RESC1608X55N]  (hidden comment: Thick Film)
R50  value 1K  [RESC1608X55N]  (hidden comment: Thick Film)
R51  value 1K  [RESC1608X55N]  (hidden comment: Thick Film)
R52  value 4K7  [RESC1608X55N]  (hidden comment: Thick Film)
R53  value 4K7  [RESC1608X55N]  (hidden comment: Thick Film)
U7  ESP8266EX  [ESFS-QFN-32_L]
U8  W25Q64FVSSIG  [WINB-SOIC-8_M]
Y3  ABM3B-26.000MHZ-10-1-U-T  [FP-ABM3B-MFG]

### Nets
GND: C87.2 C88.2 C89.2 C90.2 C91.2 C92.2 C93.2 C94.2 C95.2 C96.2 C97.2 C98.2 C99.2 C100.2 C101.2 C102.2 C103.2 C104.2 J8.1 J9.1 J10.1 J11.2(G1) J11.3(G2) Q4.2(E) Q5.2(E) R47.1 U7.33(GND) U8.4(GND) Y3.2(GND) Y3.4(GND)
VDD: C89.1 C90.1 C96.1 C97.1 C98.1 C99.1 C100.1 C101.1 C102.1 C103.1 C104.1 J8.3 J9.3 J10.3 L4.2 R45.1 R48.1 R53.1 U7.1(VDDA) U7.11(VDDPST) U7.17(VDDPST) U7.29(VDDD) U7.30(VDDA) U8.8(VCC)  [also labelled 3V3]
3V3P: C91.1 L4.1 U7.3(VDD3P3) U7.4(VDD3P3)
CLK: R44.2 U8.6(CLK)
CS/CMD: U7.20(SDIO_CMD) U8.1(~{CS})
E_EN: C87.1 Q4.3(C) R45.2 U7.7(CHIP_PU) U7.8(XPD_DCDC)
ESP_ANT: C92.1 L5.2 U7.2(LNA)
ESP_EN: R46.1
ESP_RST: C88.1 Q5.3(C) R48.2 R52.1 U7.32(EXT_RSTB)
ESP_RX: U7.25(U0RXD)
ESP_TX: U7.26(U0TXD)
ESP_XTAL_IN: C94.1 U7.28(XTAL_IN) Y3.1
ESP_XTAL_OUT: C95.1 U7.27(XTAL_OUT) Y3.3
GPIO_0: R49.1 U7.15(GPIO0)
GPIO_2: R50.1 U7.14(GPIO2)
GPIO_15: R51.1 U7.13(MTDO)
HOLD: U7.18(SDIO_DATA_2) U8.7(~{HOLD}_(IO3))
SD0: U7.22(SDIO_DATA_0) U8.2(DO_(IO1))
SD1: U7.23(SDIO_DATA_1) U8.5(DI_(IO0))
SD3: U7.19(SDIO_DATA_3) U8.3(~{WP}_(IO2))
W25Q_CS: R53.2
NetC93_1: C93.1 J11.1(SIG) L5.1
NetJ8_2: J8.2 R49.2
NetJ9_2: J9.2 R50.2
NetJ10_2: J10.2 R51.2
NetQ4_1: Q4.1(B) R46.2
NetQ5_1: Q5.1(B) R52.2
NetR44_1: R44.1 U7.21(SDIO_CLK)
NetR47_2: R47.2 U7.31(RES12K)

Not connected (* = marked no-connect by the designer): U7 5(VDD_RTC)* 6(TOUT)* 9(MTMS)* 10(MTDI)* 12(MTCK)* 16(GPIO4)* 24(GPIO5)*

### Notes on the sheet
- ESP_EN
- ESP8266
- toMcu
- ESP_RST
- EspV3p3
- EspOSC
- EspAnt
- QSpi
- EspVDD
- Labels drawn without touching a wire or pin: MTDI
- Title:
- Serial Number:
- Revision:
- 4LB_V1.0.0
- Sheet       of
- Sheet Size: A3
- 5
- Author:
- Approved By:
- AmirMahdiHasanzadeh
- Date:
- Drawn By:
- 2021/11/08
- AmirMAhdiHasanzadeh
- File:

### Library data of the parts
C87 C88 C93 C96 = CAPC_100n_0603_X7R_50V_10%: as C59 on sheet GSM; Manufacturer 2: TDK Corporation; Manufacturer Part Number 2: C1608X7R1H104K; Package / Case: 0603 (1608 Metric); Tolerance: ±10%; Supplier 1: Digi-Key; Supplier Part Number 1: 478-5052-1-ND; ComponentLink1URL: http://www.avx.com/docs/Catalogs/cx7r.pdf; ComponentLink1Description: http://www.avx.com/docs/Catalogs/cx7r.pdf; Supplier 2: Digi-Key; Supplier Part Number 2: 445-1314-1-ND; ComponentLink2URL: http://product.tdk.com/capacitor/mlcc/en/documents/mlcc_commercial_general_en.pdf; ComponentLink2Description: http://product.tdk.com/capacitor/mlcc/en/documents/mlcc_commercial_general_en.pdf
C89 C98 C99 = CMP-06035-003841-1: as C83 on sheet ADC; Height: 1.6mm; Width: 0.063inch; Min Operating Temperature: -55°C; Package Quantity: 1; Termination: SMD/SMT; Length: 3.2mm; Voltage Rating: 10V; Case/Package: 1206; Case Code (Imperial): 1206; Depth: 1.6mm; Dielectric: X7R; Voltage: 10V; Material: Ceramic; Tolerance: 10%; Voltage Rating (DC): 10V; Lead Free: Lead Free; Max Operating Temperature: 125°C; Case Code (Metric): 3216; Packaging: Tape and Reel; Thickness: 0.071inch; Radiation Hardening: No; REACH SVHC: No SVHC; Mount: Surface Mount
C90 C91 C94 C95 C100-C104 = CMP-2000-07546-2: as C85 on sheet ADC; Weight: 7.1E-05oz; Composition: Ceramic; Max Operating Temperature: 125°C; Termination: SMD/SMT; Dielectric: X7R; Length: 1.6mm; Package Quantity: 1; REACH SVHC: No SVHC; Lead Free: Lead Free; Case Code (Metric): 1608; Min Operating Temperature: -55°C; Packaging: Tape and Reel; Tolerance: 10%; Voltage Rating: 50V; Case Code (Imperial): 0603; Capacitance: 100nF; Case/Package: 0603; Voltage Rating (DC): 50V; Depth: 0.8mm; Radiation Hardening: No; Ratings: AEC-Q200; Mount: Surface Mount; Voltage: 50V; Thickness: 0.035inch; Width: 0.8mm; Height: 0.8mm
C92 = CAPC_100n_0603_X7R_50V_10%: Capacitor SMD Cer 3.0pF 10% 50V X7R 0603; Manufacturer 1: AVX Corporation; Manufacturer Part Number 1: 06035C104KAT2A; Ratings: 50V; X7R; Material: ceramic; SCDType: spec; Manufacturer 2: TDK Corporation; Manufacturer Part Number 2: C1608X7R1H104K; Package / Case: 0603 (1608 Metric); Tolerance: ±10%; Supplier 1: Digi-Key; Supplier Part Number 1: 478-5052-1-ND; ComponentLink1URL: http://www.avx.com/docs/Catalogs/cx7r.pdf; ComponentLink1Description: http://www.avx.com/docs/Catalogs/cx7r.pdf; Supplier 2: Digi-Key; Supplier Part Number 2: 445-1314-1-ND; ComponentLink2URL: http://product.tdk.com/capacitor/mlcc/en/documents/mlcc_commercial_general_en.pdf; ComponentLink2Description: http://product.tdk.com/capacitor/mlcc/en/documents/mlcc_commercial_general_en.pdf; Value: 3.0pF
C97 = CAPT_4u7_3216_16V: as C68 on sheet GSM; Package / Case: EIA 535BAAC size A; Ratings: 16V; Tolerance: ±10%; Material: Tantalum; Supplier 1: Digi-Key; Supplier Part Number 1: 718-1148-1-ND
J8-J10 = JUMP_3WAY: SMD jumper
J11 = CONN_RF_UFL: as J2 on sheet GSM; ASSEMBLY: ASSEMBLY; PRICE: 0.9$; VALUE: U.FL
L4 = CMP-14484-000379-1: SMD Inductors 4.3nH ±20% 0.56A 0.221Ω 0603; Core Material: Ferrite; Shielding: Unshielded; DC Resistance (DCR): 221mR; Current Rating: 560mA; Test Frequency: 7.96MHz; Saturation Current: 190mA; Inductance: 2.2uH; Self Resonant Frequency: 80MHz; Packaging: Tape and Reel; Tolerance: 20%; Width: 0.8mm; Length: 1.6mm; Min Operating Temperature: -40°C; RoHS Compliant: Yes; Halogen Free: Halogen Free; Height: 0.8mm; Package Quantity: 1; Mount: Surface Mount; Depth: 1mm; Height - Seated (Max): 0.039inch; Case Code (Metric): 1608; Series: CBMF; Termination: SMD/SMT; Case Code (Imperial): 0603; Military Standard: Not; Max DC Current: 560mA; Case/Package: 0603; Resistor Type: Wirewound; Radiation Hardening: No; Lead Free: Lead Free; Inductance Tolerance: 20%; DC Current: 560mA; Max Operating Temperature: 105°C
L5 = CMP-14484-000379-1: SMD Inductors 2.2nH ±20% 0.56A 0.221Ω 0603; Core Material: Ferrite; Shielding: Unshielded; DC Resistance (DCR): 221mR; Current Rating: 560mA; Test Frequency: 7.96MHz; Saturation Current: 190mA; Inductance: 2.2uH; Self Resonant Frequency: 80MHz; Packaging: Tape and Reel; Tolerance: 20%; Width: 0.8mm; Length: 1.6mm; Min Operating Temperature: -40°C; RoHS Compliant: Yes; Halogen Free: Halogen Free; Height: 0.8mm; Package Quantity: 1; Mount: Surface Mount; Depth: 1mm; Height - Seated (Max): 0.039inch; Case Code (Metric): 1608; Series: CBMF; Termination: SMD/SMT; Case Code (Imperial): 0603; Military Standard: Not; Max DC Current: 560mA; Case/Package: 0603; Resistor Type: Wirewound; Radiation Hardening: No; Lead Free: Lead Free; Inductance Tolerance: 20%; DC Current: 560mA; Max Operating Temperature: 105°C
Q4 Q5 = NPN: NPN Bipolar Transistor; Published: 8-Jun-2000; LatestRevisionDate: 17-Jul-2002; LatestRevisionNote: Re-released for DXP Platform.; PackageReference: TO-226-AA; Publisher: Altium Limited; PackageDescription: TO, Flat Index; 3 In-Line, Axial Leads; Body Dia. 4.8mm; Leads 0.55 x 0.51 mm (max); Code_JEDEC: TO-226-AA
R44-R46 R48 R52 R53 = RES_4K7_0603_5%: as R15 on sheet GSM; Package / Case: 0603 (1608 metric); Tolerance: ±5%; Material: Thick Film; Supplier 1: Digi-Key; Supplier Part Number 1: 541-4.7KGCT-ND
R47 = CMP-2100-03667-1: Chip Resistor, 0 Ohm, +/- 5%, 0.1 W, -55 to 155 degC, 0603 (1608 Metric), RoHS, Tape and Reel; Manufacturer: Yageo; Temperature Coefficient: 200ppm/degreesC; Voltage Rating: 50V; Power Rating: 100mW; Resistance: 0mOhm; Width: 0.8mm; Max Operating Temperature: 155degC; Tolerance: 5%; Package Reference: 0603; Height: 0.45mm; Depth: 0.8mm; Package Description: 2-Pin Surface Mount Device, Body 1.6 x 0.8 mm; Termination: SMD/SMT; Package Quantity: 5000; Case/Package: 0603; Case Code (Imperial): 0603; Radiation Hardening: No; Number of Pins: 2; Length: 1.6mm; Lead Free: LeadFree; Voltage Rating (DC): 50V; Military Standard: Not; Datasheet URL: http://www.yageo.com/NewPortal/yageodocoutput?fileName=/pdf/R-Chip/PYu-RC_Group_51_RoHS_L_5.pdf; Manufacturer URL: http://www.yageo.com/; Packaging: TapeandReel; Case Code (Metric): 1608; Min Operating Temperature: -55degC; Composition: ThickFilm; RoHSCompliant: true; Contact Plating: Tin; Datasheet Version: Rev. 5, 10/2016; REACH SVHC: NoSVHC
R49-R51 = RES_4K7_0603_5%: Resistor SMD chip 1k Ohm 0.1W 5% 0603; Manufacturer 1: Vishay/Dale; Manufacturer Part Number 1: CRCW06034K70JNEA; Ratings: 1/10 W; SCDType: spec; Package / Case: 0603 (1608 metric); Tolerance: ±5%; Material: Thick Film; Supplier 1: Digi-Key; Supplier Part Number 1: 541-4.7KGCT-ND
U7 = CMP-2000-07453-1: Low-Power, Highly-Integrated Wi-Fi Solution, 2.5 to 3.6 V, 80 mA, -40 to 125 degC, 32-Pin QFN; Manufacturer: Espressif Systems; Mounting Technology: SurfaceMount; Datasheet URL: http://espressif.com/sites/default/files/documentation/0a-esp8266ex_datasheet_en.pdf; Package Reference: QFN-32; Package Description: 32-Pin Quad Falt No-Lead, Body 5 x 5 mm, Pitch 0.5 mm; Manufacturer URL: http://espressif.com; Datasheet Version: Rev. 5.4, 04/2017
U8 = CMP-2000-05007-1: 3V 64M-Bit Serial Flash Memory with Dual/Quad SPI & QPI, 2.7 to 3.6 V, -40 to 85 degC, 8-Pin SOIC, RoHS, Tape and Reel; Manufacturer: Winbond; Boot Type: Bottom/Top; Word Size: 8b; Cell Type: NOR; Operating Supply Voltage (Min): 2.7V; Operating Supply Voltage (Max): 3.6V; Rad Hardened: No; Density: 67108864Bit; Address Bus: 1b; Supply Current: 40mA; Sync/Async: Synchronous; Number of Words: 8M; Programmable: Yes; Operating Supply Voltage (Typ): 3/3.3V; Access Time (Max): 8.5ns; Interface Type: Serial(SPI); Operating Temperature Classification: Industrial; Datasheet Version: Rev. D, 12/2011; Operating Temp Range: -40Cto85C; Operating Temperature (Max): 85C; Pin Count: 8; Mounting: SurfaceMount; Program/Erase Volt (Typ): 2.7to3.6V; Operating Temperature (Min): -40C; Package Description: 8-Pin Small Outline Integrated Circuit, Body 5.28 x 5.28 mm, Pitch 1.27 mm; Datasheet URL: https://datasheet.ciiva.com/15126/getdatasheetpartid-552937-15126648.pdf; Package Reference: SS-8; Manufacturer URL: http://www.winbond.com/hq/index.html?__locale=en; Package Type: SOIC
Y3 = CMP-27762-000013-1: CRYSTAL 26.0000MHZ 10PF SMD; Manufacturer: Abracon; Tolerance: 10ppm; Esr: 50Ω; Frequency: 26MHz; Mouser Description: Crystal 26MHz ±10ppm (Tol) ±10ppm (Stability) 10pF FUND 50Ohm 4-Pin CSMD T/R; Load Capacitance: 10pF; RoHS: TRUE; Device Class L1: Passive Components; Height: 1.1mm; ComponentLink2URL: http://www.abracon.com/Resonators/abm3b.pdf; Octopart: https://octopart.com/abm3b-26.000mhz-10-1-u-t-abracon-315160; Manufacturer Part Number: ABM3B-26.000MHZ-10-1-U-T; Temperature Range Low: -10°C; ComponentLink2Description: Datasheet; Temperature: -10°C to +60°C; Device Class L2: Crystals / Oscillators; Device Class L3: Crystals; Series: ABM3B; Lead Free: Yes; Digikey Description: CRYSTAL 26.0000MHZ 10PF SMD; Temperature Range High: +60°C; Package: ABM3B; Automotive: No; Category: Crys; Stability: 10ppm

## Sheet RAM-k4s561632h-uc75.SchDoc
size A4; SheetNumber: 6; SheetTotal: 8
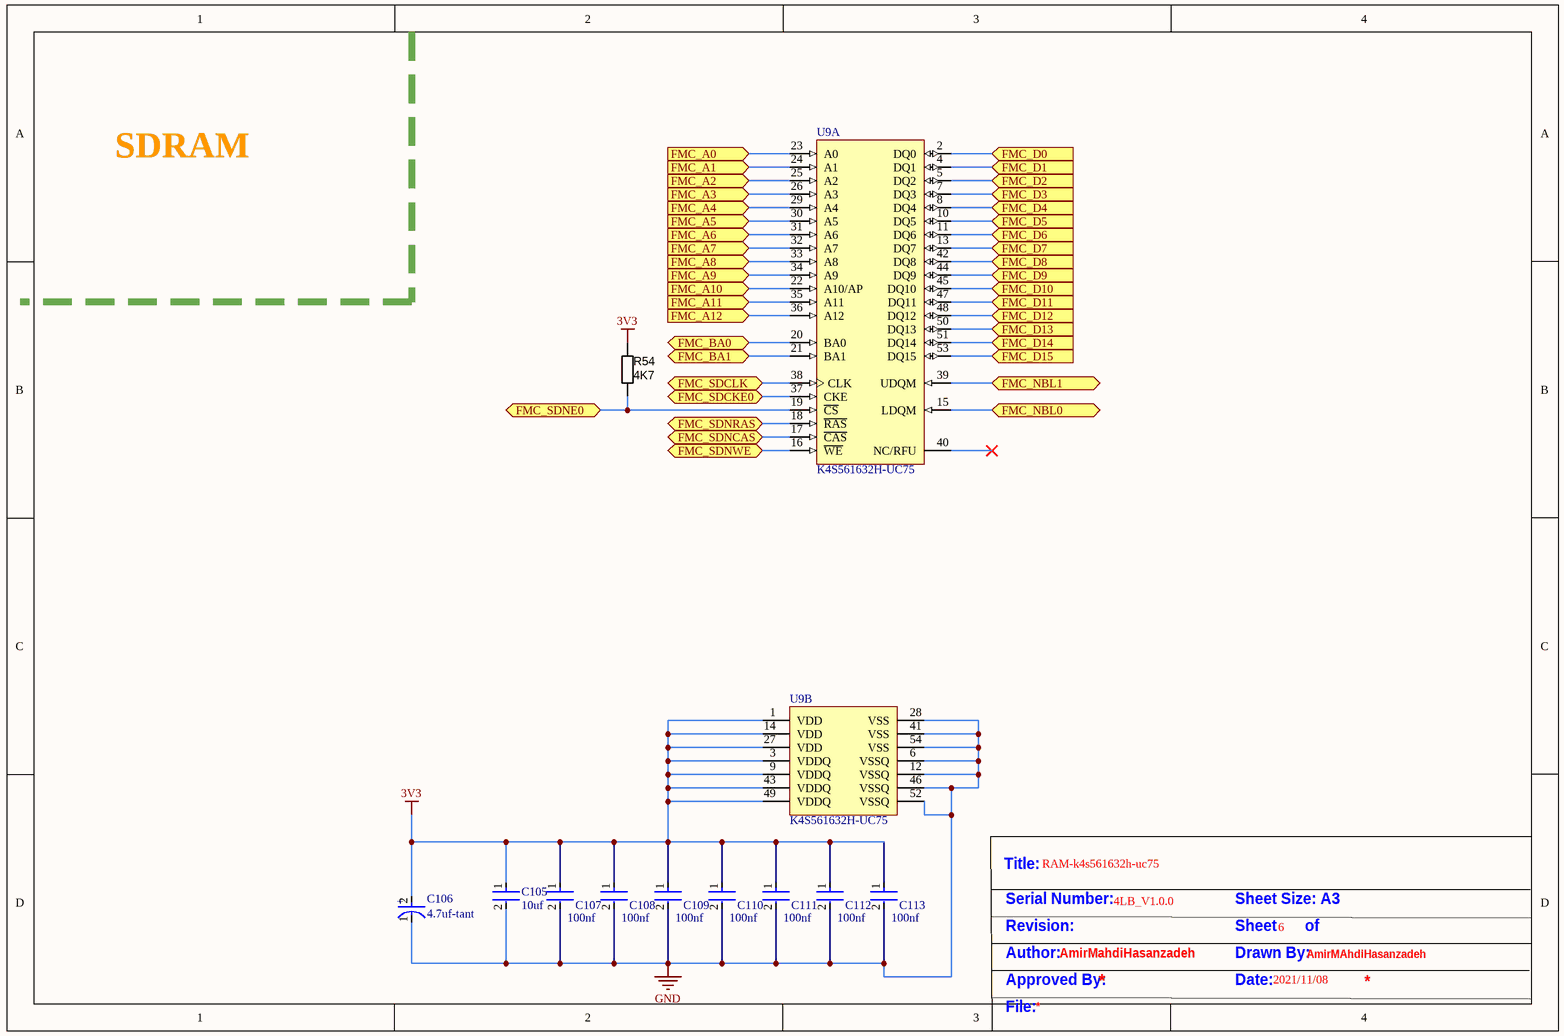
[diagram p6: RAM-k4s561632h-uc75.SchDoc]

### Parts
C105  10uf  [FP-C3216-160-0_2-IPC_A]
C106  4.7uf-tant  [FP-T491A475K016AT-MFG]
C107  100nf  [FP-CGA3E-0_3-0_1-IPC_A]
C108  100nf  [FP-CGA3E-0_3-0_1-IPC_A]
C109  100nf  [FP-CGA3E-0_3-0_1-IPC_A]
C110  100nf  [FP-CGA3E-0_3-0_1-IPC_A]
C111  100nf  [FP-CGA3E-0_3-0_1-IPC_A]
C112  100nf  [FP-CGA3E-0_3-0_1-IPC_A]
C113  100nf  [FP-CGA3E-0_3-0_1-IPC_A]
R54  value 4K7  [RESC1608X55N]  (hidden comment: Thick Film)
U9  K4S561632H-UC75  [SAMS-TSOP-54_L]  (parts A,B of 2)

### Ports
FMC_A0 (in), FMC_A1 (in), FMC_A2 (in), FMC_A3 (in), FMC_A4 (in), FMC_A5 (in), FMC_A6 (in), FMC_A7 (in), FMC_A8 (in), FMC_A9 (in), FMC_A10 (in), FMC_A11 (in), FMC_A12 (in), FMC_BA0 (bidir), FMC_BA1 (bidir), FMC_D0 (in), FMC_D1 (in), FMC_D2 (in), FMC_D3 (in), FMC_D4 (in), FMC_D5 (in), FMC_D6 (in), FMC_D7 (in), FMC_D8 (in), FMC_D9 (in), FMC_D10 (in), FMC_D11 (in), FMC_D12 (in), FMC_D13 (in), FMC_D14 (in), FMC_D15 (in), FMC_NBL0 (bidir), FMC_NBL1 (bidir), FMC_SDCKE0 (bidir), FMC_SDCLK (bidir), FMC_SDNCAS (bidir), FMC_SDNE0 (bidir), FMC_SDNRAS (bidir), FMC_SDNWE (bidir)

### Nets
3V3: C105.1 C106.2(A) C107.1 C108.1 C109.1 C110.1 C111.1 C112.1 C113.1 R54.1 U9.1(VDD) U9.3(VDDQ) U9.9(VDDQ) U9.14(VDD) U9.27(VDD) U9.43(VDDQ) U9.49(VDDQ)  [project net VDD]
GND: C105.2 C106.1(C) C107.2 C108.2 C109.2 C110.2 C111.2 C112.2 C113.2 U9.6(VSSQ) U9.12(VSSQ) U9.28(VSS) U9.41(VSS) U9.46(VSSQ) U9.52(VSSQ) U9.54(VSS)
NetR54_2: R54.2 U9.19(~{CS}) ; port FMC_SDNE0
NetU1_10: U9.23(A0) ; port FMC_A0
NetU1_11: U9.24(A1) ; port FMC_A1
NetU1_12: U9.25(A2) ; port FMC_A2
NetU1_13: U9.26(A3) ; port FMC_A3
NetU1_14: U9.29(A4) ; port FMC_A4
NetU1_15: U9.30(A5) ; port FMC_A5
NetU1_26: U9.16(~{WE}) ; port FMC_SDNWE
NetU1_29: U9.37(CKE) ; port FMC_SDCKE0
NetU1_49: U9.18(~{RAS}) ; port FMC_SDNRAS
NetU1_50: U9.31(A6) ; port FMC_A6
NetU1_53: U9.32(A7) ; port FMC_A7
NetU1_54: U9.33(A8) ; port FMC_A8
NetU1_55: U9.34(A9) ; port FMC_A9
NetU1_56: U9.22(A10/AP) ; port FMC_A10
NetU1_57: U9.35(A11) ; port FMC_A11
NetU1_58: U9.8(DQ4) ; port FMC_D4
NetU1_59: U9.10(DQ5) ; port FMC_D5
NetU1_60: U9.11(DQ6) ; port FMC_D6
NetU1_63: U9.13(DQ7) ; port FMC_D7
NetU1_64: U9.42(DQ8) ; port FMC_D8
NetU1_65: U9.44(DQ9) ; port FMC_D9
NetU1_66: U9.45(DQ10) ; port FMC_D10
NetU1_67: U9.47(DQ11) ; port FMC_D11
NetU1_68: U9.48(DQ12) ; port FMC_D12
NetU1_77: U9.50(DQ13) ; port FMC_D13
NetU1_78: U9.51(DQ14) ; port FMC_D14
NetU1_79: U9.53(DQ15) ; port FMC_D15
NetU1_85: U9.2(DQ0) ; port FMC_D0
NetU1_86: U9.4(DQ1) ; port FMC_D1
NetU1_87: U9.36(A12) ; port FMC_A12
NetU1_89: U9.20(BA0) ; port FMC_BA0
NetU1_90: U9.21(BA1) ; port FMC_BA1
NetU1_93: U9.38(CLK) ; port FMC_SDCLK
NetU1_114: U9.5(DQ2) ; port FMC_D2
NetU1_115: U9.7(DQ3) ; port FMC_D3
NetU1_132: U9.17(~{CAS}) ; port FMC_SDNCAS
NetU1_141: U9.15(LDQM) ; port FMC_NBL0
NetU1_142: U9.39(UDQM) ; port FMC_NBL1

Not connected (* = marked no-connect by the designer): U9 40(NC/RFU)*

### Notes on the sheet
- SDRAM
- Title:
- Serial Number:
- RAM-k4s561632h-uc75
- 4LB_V1.0.0
- Sheet Size: A3
- Author:
- Approved By:
- Revision:
- AmirMahdiHasanzadeh
- Date:
- Sheet       of
- Drawn By:
- 2021/11/08
- 6
- AmirMAhdiHasanzadeh
- File:
- (in symbol CMP-2000-07188-2) +

### Library data of the parts
C105 = CMP-2000-06045-2: Multilayer Ceramic Capacitors 10uF ±10% 50V X5R SMD 1206; Min Operating Temperature: -55°C; Weight: 0.000571oz; Tolerance: 10%; Lead Free: Lead Free; REACH SVHC: No SVHC; Dielectric Material: Ceramic; Termination: SMD/SMT; Radiation Hardening: No; Case Code (Metric): 3216; Max Operating Temperature: 85°C; Voltage Rating (DC): 50V; Packaging: Tape and Reel; Height: 1.6mm; Voltage: 50V; Dielectric: X5R; Mount: Surface Mount; Voltage Rating: 50V; Capacitance: 10uF; Length: 3.2mm; RoHS Compliant: Yes; Thickness: 0.071inch; Depth: 1.6mm; Width: 0.063inch; Case/Package: 1206; Series: C; Package Quantity: 1; Resistor Type: Ceramic; Case Code (Imperial): 1206; Construction: Flat
C106 = CMP-2000-07188-2: CAP TANT 4.7UF 10% 16V 1206; Polarity: Polar; Life (Hours): 2000Hour; Ripple Current: 137mA; ESR (Equivalent Series Resistance): 4R; Dielectric Material: Tantalum; Leakage Current: 800nA; Dissipation Factor: 6%; Voltage Rating: 16V; Case Code (Imperial): 1206; Radiation Hardening: No; Width: 1.6mm; Case/Package: 1206; Mount: Surface Mount; Voltage Rating (DC): 16V; Max Operating Temperature: 125°C; Case Code (Metric): 3216; Features: General Purpose; Number of Pins: 2; Depth: 1.6mm; Length: 3.2mm; Package Quantity: 1; Termination: SMD/SMT; Construction: Flat; Height: 1.6mm; RoHS Compliant: Yes; Tolerance: 10%; Min Operating Temperature: -55°C; Packaging: Tape and Reel; Capacitance: 4.7uF; Lead Free: Lead Free; Series: T491; REACH SVHC: No SVHC; Height - Seated (Max): 0.071inch; Voltage: 16V
C107-C113 = CMP-2000-07546-2: as C85 on sheet ADC; Weight: 7.1E-05oz; Composition: Ceramic; Max Operating Temperature: 125°C; Termination: SMD/SMT; Dielectric: X7R; Length: 1.6mm; Package Quantity: 1; REACH SVHC: No SVHC; Lead Free: Lead Free; Case Code (Metric): 1608; Min Operating Temperature: -55°C; Packaging: Tape and Reel; Tolerance: 10%; Voltage Rating: 50V; Case Code (Imperial): 0603; Capacitance: 100nF; Case/Package: 0603; Voltage Rating (DC): 50V; Depth: 0.8mm; Radiation Hardening: No; Ratings: AEC-Q200; Mount: Surface Mount; Voltage: 50V; Thickness: 0.035inch; Width: 0.8mm; Height: 0.8mm
R54 = RES_4K7_0603_5%: as R15 on sheet GSM; Package / Case: 0603 (1608 metric); Tolerance: ±5%; Material: Thick Film; Supplier 1: Digi-Key; Supplier Part Number 1: 541-4.7KGCT-ND
U9 = CMP-2000-06510-1: H-Die SDRAM Specification, 256 Mbits, 130 mA, 3.3 V, 0 to 70 degC, 54-Pin TSOP, RoHS; Manufacturer: Samsung Electro-Mechanics; Datasheet URL: http://datasheet.octopart.com/K4S560832H-UC75-Samsung-datasheet-13141326.pdf; Mounting Technology: SurfaceMount; Datasheet Version: Rev. 1.0, 10/2005; Package Reference: TSOP-54; Manufacturer URL: http://www.samsungsem.com/global/index.jsp; Package Description: 54-Pin Thin Small Outline Package, Body 22.22 x 10.16 mm, Pitch 0.8 mm

## Sheet TFTLCD.SchDoc
size A3; SheetNumber: 7; SheetTotal: 8
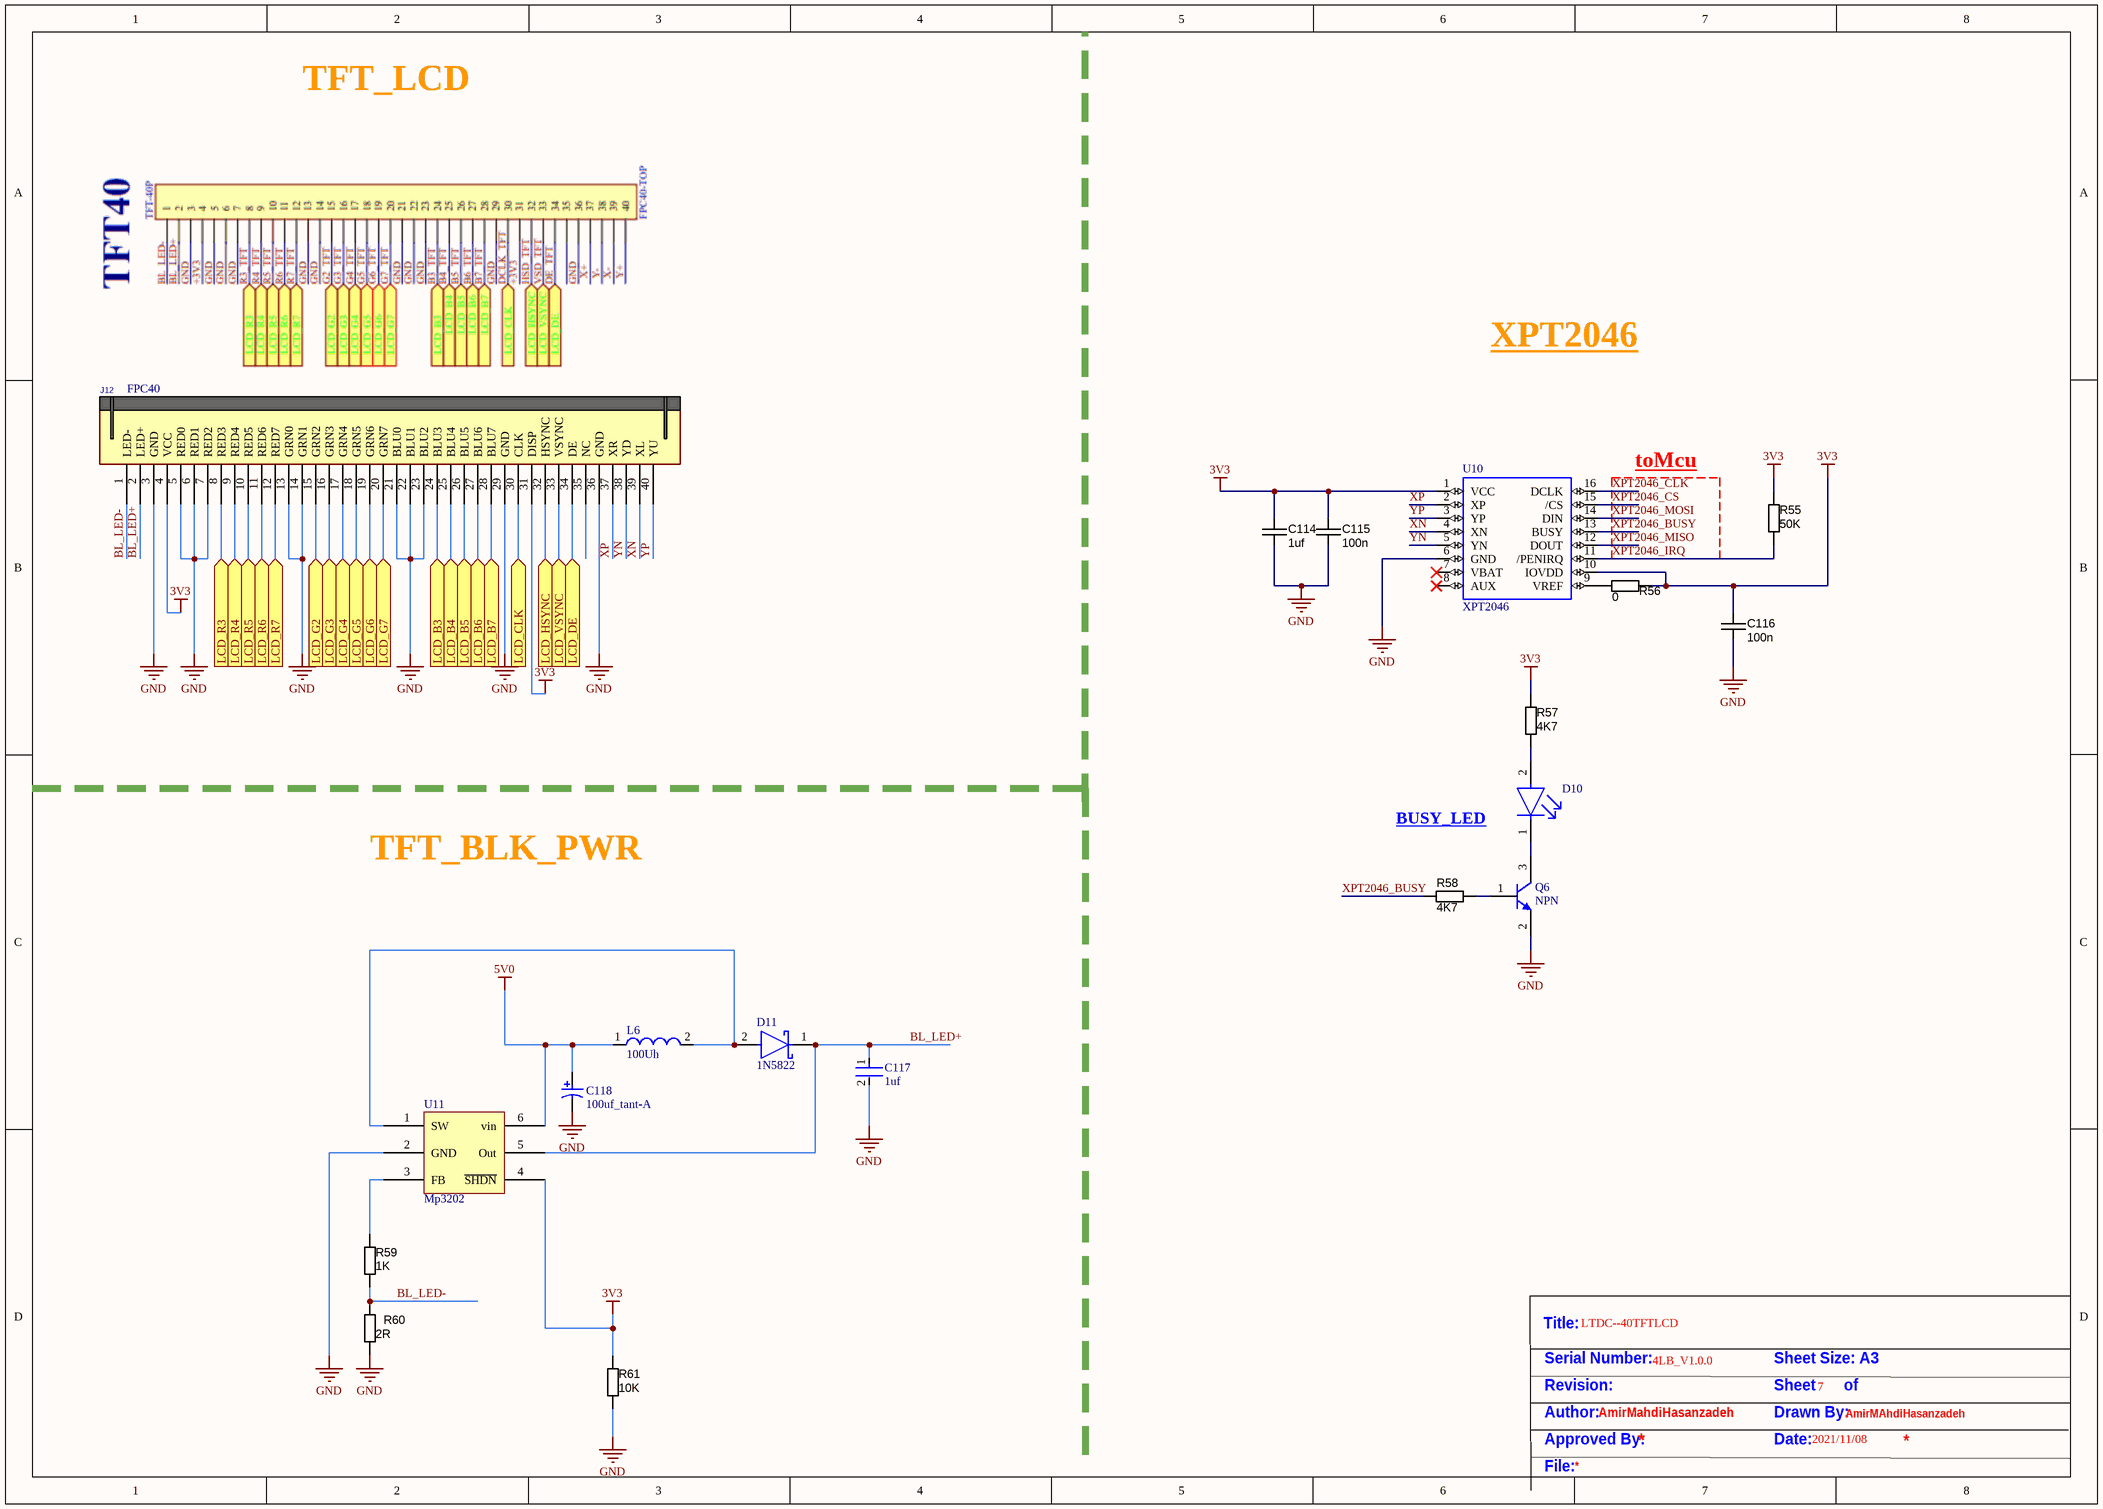
[diagram p7: TFTLCD.SchDoc]

### Parts
C114  1uf  [CAPC3216X180N]
C115  value 100n  [CAPC1608X90N]  (hidden comment: approved sub OK)
C116  value 100n  [CAPC1608X90N]  (hidden comment: approved sub OK)
C117  1uf  [FP-GRM31C-0_2-e0_3_0_8-MFG]
C118  100uf_tant-A  [AVX-TPSA106K010R1800_M]
D10  LTST-C191TBKT  [FP-LTST-C191TBKT-MFG]  (value not drawn)
D11  1N5822  [FP-DO-201AD-MFG]
J12  FPC40  [FPC50_40]
L6  100Uh  [WE-PD2-M]
Q6  NPN  [SOT23-3]
R55  value 50K  [RESC1608X55N]  (hidden comment: Thick Film)
R56  value 0  [RESC1608X55N]  (hidden comment: Thick Film)
R57  value 4K7  [RESC1608X55N]  (hidden comment: Thick Film)
R58  value 4K7  [RESC1608X55N]  (hidden comment: Thick Film)
R59  value 1K  [RESC1608X55N]  (hidden comment: Thick Film)
R60  value 2R  [RESC1608X55N]  (hidden comment: Thick Film)
R61  value 10K  [RESC1608X55N]  (hidden comment: Thick Film)
U10  XPT2046  [TSSOP-16]
U11  Mp3202  [SOT95P280X145-6N]

### Ports
LCD_B3 (in), LCD_B4 (in), LCD_B5 (in), LCD_B6 (in), LCD_B7 (in), LCD_CLK (in), LCD_DE (in), LCD_G2 (in), LCD_G3 (in), LCD_G4 (in), LCD_G5 (in), LCD_G6 (in), LCD_G7 (in), LCD_HSYNC (in), LCD_R3 (in), LCD_R4 (in), LCD_R5 (in), LCD_R6 (in), LCD_R7 (in), LCD_VSYNC (in)

### Nets
3V3: C114.1 C115.1 C116.1 J12.4(VCC) J12.31(DISP) R55.1 R56.1 R57.2 R61.2 U10.1(VCC) U10.10(IOVDD) U11.4(~{SHDN})  [project net VDD]
5V0: C118.1 L6.1 U11.6(vin)
GND: C114.2 C115.2 C116.2 C117.2 C118.2 J12.3(GND) J12.5(RED0) J12.6(RED1) J12.7(RED2) J12.13(GRN0) J12.14(GRN1) J12.21(BLU0) J12.22(BLU1) J12.23(BLU2) J12.29(GND) J12.36(GND) Q6.2(E) R60.1 R61.1 U10.6(GND) U11.2(GND)
BL_LED+: C117.1 D11.1(C) J12.2(LED+) U11.5(Out)
BL_LED-: J12.1(LED-) R59.2 R60.2
XN: J12.39(XL) U10.4(XN)
XP: J12.37(XR) U10.2(XP)
XPT2046_BUSY: R58.1 U10.13(BUSY)
XPT2046_CLK: U10.16(DCLK)
XPT2046_CS: U10.15(/CS)
XPT2046_IRQ: R55.2 U10.11(/PENIRQ)
XPT2046_MISO: U10.12(DOUT)
XPT2046_MOSI: U10.14(DIN)
YN: J12.38(YD) U10.5(YN)
YP: J12.40(YU) U10.3(YP)
NetD10_1: D10.1(C) Q6.3(C)
NetD10_2: D10.2(A) R57.1
NetD11_2: D11.2(A) L6.2 U11.1(SW)
NetJ12_8: J12.8(RED3) ; port LCD_R3
NetJ12_9: J12.9(RED4) ; port LCD_R4
NetJ12_10: J12.10(RED5) ; port LCD_R5
NetJ12_11: J12.11(RED6) ; port LCD_R6
NetJ12_12: J12.12(RED7) ; port LCD_R7
NetJ12_15: J12.15(GRN2) ; port LCD_G2
NetJ12_16: J12.16(GRN3) ; port LCD_G3
NetJ12_17: J12.17(GRN4) ; port LCD_G4
NetJ12_18: J12.18(GRN5) ; port LCD_G5
NetJ12_19: J12.19(GRN6) ; port LCD_G6
NetJ12_20: J12.20(GRN7) ; port LCD_G7
NetJ12_24: J12.24(BLU3) ; port LCD_B3
NetJ12_25: J12.25(BLU4) ; port LCD_B4
NetJ12_26: J12.26(BLU5) ; port LCD_B5
NetJ12_27: J12.27(BLU6) ; port LCD_B6
NetJ12_28: J12.28(BLU7) ; port LCD_B7
NetJ12_30: J12.30(CLK) ; port LCD_CLK
NetJ12_32: J12.32(HSYNC) ; port LCD_HSYNC
NetJ12_33: J12.33(VSYNC) ; port LCD_VSYNC
NetJ12_34: J12.34(DE) ; port LCD_DE
NetQ6_1: Q6.1(B) R58.2
NetR56_2: R56.2 U10.9(VREF)
NetR59_1: R59.1 U11.3(FB)

Not connected (* = marked no-connect by the designer): J12 35(NC); U10 7(VBAT)* 8(AUX)*

### Notes on the sheet
- TFT_LCD
- XPT2046
- toMcu
- BUSY_LED
- TFT_BLK_PWR
- Title:
- LTDC--40TFTLCD
- Serial Number:
- Revision:
- 4LB_V1.0.0
- Sheet       of
- Sheet Size: A3
- 7
- Author:
- Approved By:
- AmirMahdiHasanzadeh
- Date:
- Drawn By:
- 2021/11/08
- AmirMAhdiHasanzadeh
- File:

### Library data of the parts
C114 = CAPC_47n_1206_X7R_50V_10%: Capacitor SMD Cer 47nF 10% 50V X7R 1206; Manufacturer 1: Yageo; Manufacturer Part Number 1: CC1206KRX7R9BB473; Ratings: 50V; X7R; SCDType: spec; Package / Case: 1206 (3216 Metric); Tolerance: ±10%; Operating Temperature: -55°C ~ 125°C; Size / Dimension: 0.126" L x 0.063" W (3.20mm x 1.60mm); Supplier 1: Digi-Key; Voltage - Rated: 50V; Supplier Part Number 1: 311-1178-1-ND; Value: 1uf
C115 C116 = CAPC_100n_0603_X7R_50V_10%: as C59 on sheet GSM; Manufacturer 2: TDK Corporation; Manufacturer Part Number 2: C1608X7R1H104K; Package / Case: 0603 (1608 Metric); Tolerance: ±10%; Supplier 1: Digi-Key; Supplier Part Number 1: 478-5052-1-ND; ComponentLink1URL: http://www.avx.com/docs/Catalogs/cx7r.pdf; ComponentLink1Description: http://www.avx.com/docs/Catalogs/cx7r.pdf; Supplier 2: Digi-Key; Supplier Part Number 2: 445-1314-1-ND; ComponentLink2URL: http://product.tdk.com/capacitor/mlcc/en/documents/mlcc_commercial_general_en.pdf; ComponentLink2Description: http://product.tdk.com/capacitor/mlcc/en/documents/mlcc_commercial_general_en.pdf
C117 = CMP-06035-003841-1: Chip Multilayer Ceramic Capacitors for General Purpose, 1206, 22uF, X7R, 15%, 10%, 10V; Height: 1.6mm; Width: 0.063inch; Min Operating Temperature: -55°C; Package Quantity: 1; Termination: SMD/SMT; Length: 3.2mm; Voltage Rating: 10V; Case/Package: 1206; Capacitance: 22uF; Case Code (Imperial): 1206; Depth: 1.6mm; Dielectric: X7R; Voltage: 10V; Material: Ceramic; Tolerance: 10%; Voltage Rating (DC): 10V; Lead Free: Lead Free; Max Operating Temperature: 125°C; Case Code (Metric): 3216; Packaging: Tape and Reel; Thickness: 0.071inch; Radiation Hardening: No; REACH SVHC: No SVHC; Mount: Surface Mount
C118 = CMP-2000-07288-1: Tantalum Capacitor, 22uF, +/- 10%, 10 V, -55 to 125 degC, 2-Pin Molded, RoHS, Tape and Reel; Manufacturer: AVX; Manufacturer Size Code: A; Online Catalog: TPSSeries; Other Names: 478-3317-1; Kits: 478-3444-ND-KITTANTCAPTPSSERIES; ESR (Equivalent Series Resistance): 1.8Ohm; Catalog Drawings: TPSSeriesSides; Product Training Modules: ComponentSolutionsforSmartMeterApplications; Voltage - Rated: 10V; EDA / CAD Models: DownloadfromAcceleratedDesigns; Featured Product: TPSCapacitors; Capacitance: 10µF; Mounting Type: SurfaceMount; Packaging: CutTape(CT); Package Reference: TPSA106K010R1800; Size / Dimension: 0.126"Lx0.063"W(3.20mmx1.60mm); Package / Case: 1206(3216Metric); Mounting Technology: SurfaceMount; Family: TantalumCapacitors; Manufacturer URL: http://www.avx.com/; Datasheet URL: http://www.farnell.com/datasheets/1441576.pdf; Datasheet Version: 03/2011; Height - Seated (Max): 0.071"(1.80mm); Type: Molded; Features: GeneralPurpose; Lifetime @ Temp.: -; Lead Spacing: -; Standard Package: 1; Package Description: 2-Pin Surface Mount Device, Body 3.2 x 1.65 mm; Tolerance: ±10%; Category: Capacitors; Operating Temperature: -55°C~125°C; Series: TPS
D10 = CMP-22017-000008-1: as D6 on sheet GSM; Case Code (Metric): 1608; Packaging: Tape and Reel; Case/Package: 0603; Depth: 1.6mm; Mount: Surface Mount; Lead Free: Lead Free; Min Operating Temperature: -20°C; Lens Transparency: Clear; Illumination Color: Blue; Height: 0.55mm; Test Current: 20mA; Case Code (Imperial): 0603; Max Operating Temperature: 80°C; Number of Pins: 2; Length: 0.8mm; Radiation Hardening: No; Package Quantity: 1; Number of LEDs: 1; Width: 0.8mm; Color: Blue
D11 = CMP-12187-000025-1: DIODE SCHOTTKY 40V 3A DO201AD; Manufacturer: STMicroelectronics; Max Junction Temp: +150°C; Peak Reverse Current: 2mA; Max Surge Forward Current: 80A; Temperature Range High: +150°C; Automotive: No; RoHS: TRUE; ComponentLink2Description: Datasheet; Manufacturer Part Number: 1N5822; Lead Free: Yes; Octopart: https://octopart.com/1n5822-stmicroelectronics-323225; Device Class L2: Diodes; Max Repetitive Reverse Voltage: 40V; Temperature: to +150°C; Height: 5.3mm; Category: Diode; Digikey Description: DIODE SCHOTTKY 40V 3A DO201AD; ComponentLink2URL: https://www.st.com/resource/en/datasheet/1n5822.pdf; Device Class L3: Schottky Diodes; Device Class L1: Discrete Semiconductors; Forward Current: 3A; Mouser Description: Schottky Diodes & Rectifiers Vr/40V Io/3A BULK; Package: DO-201AD
J12 = FPC50_40: CONN, FPC, 0.50mm pitch, RightAngle, Bot. Contact; DESC: FH12F-40S-0.5SH, FH12S-40S-0.5SH; MANF: MOLEX, Hirose; MANF_P#: 54132‐4062, FH12-40S-0.5SH; VALUE: FPC40
L6 = CMP-0227-00441-1: SMD Power Inductor WE-PD2, L = 100 µH; Inductance: 100 ÂµH; ComponentLink2Description: Datasheet; ComponentLink1URL: http://www.we-online.com; DatasheetVersion: ver 2, Jun-2005; ComponentLink2URL: http://www.we-online.de/katalog/media/pdf/74477420.pdf; PackageDescription: SMD Inductor, 2-Leads, Body 5.8 x 5.2 mm; PackageVersion: 2005; ComponentLink1Description: Manufacturer Link; PackageReference: WE-PD2-M
Q6 = NPN: NPN Bipolar Transistor; Published: 8-Jun-2000; LatestRevisionDate: 17-Jul-2002; LatestRevisionNote: Re-released for DXP Platform.; PackageReference: TO-226-AA; Publisher: Altium Limited; PackageDescription: TO, Flat Index; 3 In-Line, Axial Leads; Body Dia. 4.8mm; Leads 0.55 x 0.51 mm (max); Code_JEDEC: TO-226-AA
R55 = RES_4K7_0603_5%: Resistor SMD chip 10K Ohm 0.1W 5% 0603; Manufacturer 1: Vishay/Dale; Manufacturer Part Number 1: CRCW06034K70JNEA; Ratings: 1/10 W; SCDType: spec; Package / Case: 0603 (1608 metric); Tolerance: ±5%; Material: Thick Film; Supplier 1: Digi-Key; Supplier Part Number 1: 541-4.7KGCT-ND
R56 = RES_4K7_0603_5%: as R12 on sheet GSM; Package / Case: 0603 (1608 metric); Tolerance: ±5%; Material: Thick Film; Supplier 1: Digi-Key; Supplier Part Number 1: 541-4.7KGCT-ND
R57-R61 = RES_4K7_0603_5%: as R15 on sheet GSM; Package / Case: 0603 (1608 metric); Tolerance: ±5%; Material: Thick Film; Supplier 1: Digi-Key; Supplier Part Number 1: 541-4.7KGCT-ND
U10 = XPT2046: RASPBERRY PI 3.5 TFT DISPLAY; MF: Xptek; Value: *; Package: Package; Availability: Unavailable; SnapEDA_Link: https://www.snapeda.com/parts/XPT2046/Xptek/view-part/5164510/?ref=snap; MP: XPT2046; Price: None; Check_prices: https://www.snapeda.com/parts/XPT2046/Xptek/view-part/5164510/?ref=eda